# EasyEDA Pro project LVDS_VHDCI_1.0.eprj

# Schematic LVDS_VHDCI_MCU_1
Page Name: P1; Project Name: LVDS_VHDCI_1.0; Schematic Name: LVDS_VHDCI_MCU_1; Update Date: 2023-11-03; Company: 嘉立创EDA; Page Size: A4; Version: V1.0
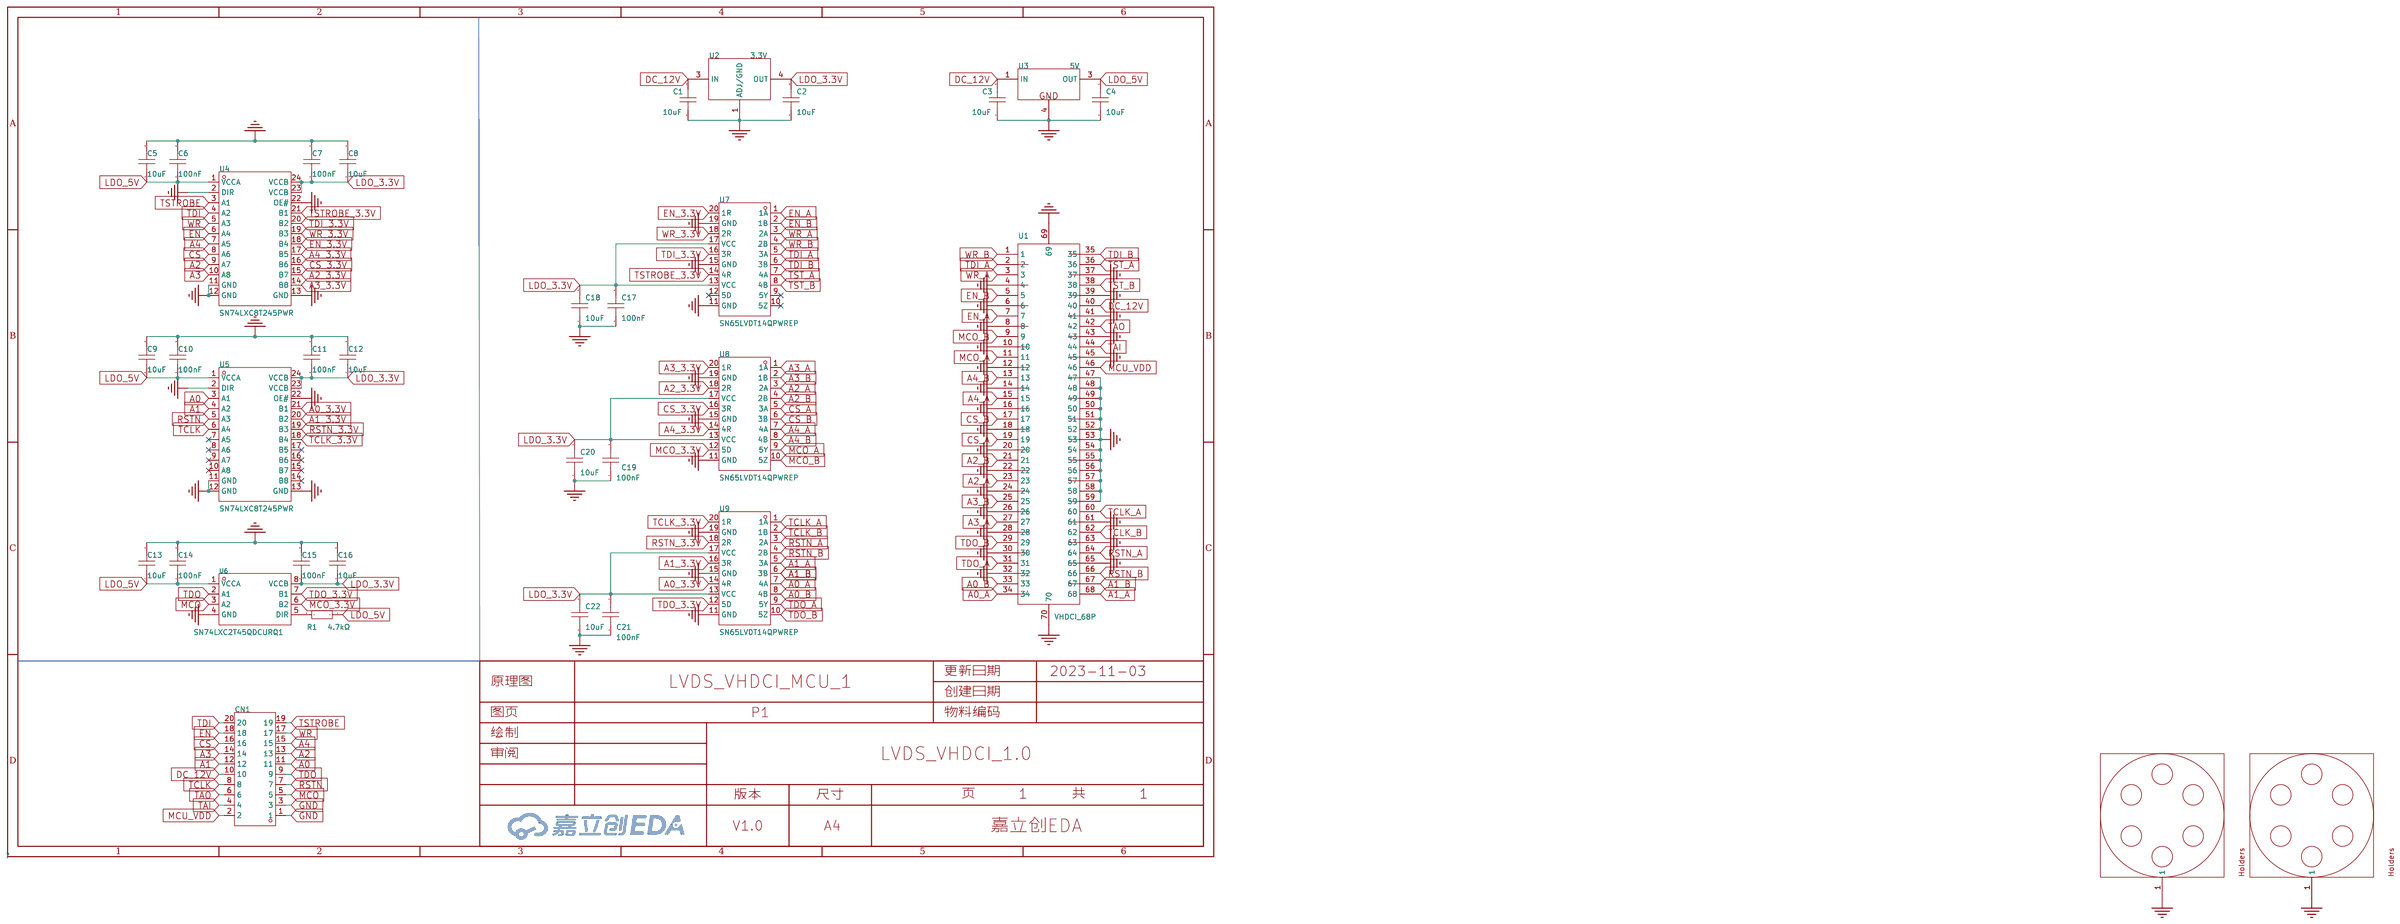
[diagram p0: schematic sheet]

## Parts
C1  10uF  [C0603]
C2  10uF  [C0603]
C3  10uF  [C0603]
C4  10uF  [C0603]
C5  10uF  [C0603]
C6  100nF  [C0603]
C7  100nF  [C0603]
C8  10uF  [C0603]
C9  10uF  [C0603]
C10  100nF  [C0603]
C11  100nF  [C0603]
C12  10uF  [C0603]
C13  10uF  [C0603]
C14  100nF  [C0603]
C15  100nF  [C0603]
C16  10uF  [C0603]
C17  100nF  [C0603]
C18  10uF  [C0603]
C19  100nF  [C0603]
C20  10uF  [C0603]
C21  100nF  [C0603]
C22  10uF  [C0603]
CN1  BH254V-20P  [CONN-TH_20P-P2.54_0702462001]
J5  -  [DEMO板安装孔]
J6  -  [DEMO板安装孔]
R1  4.7kΩ  [R0603]
U1  VHDCI_68P  [VHDCI_68P]
U2  3.3V  [TO-263-2_L10.0-W9.1-P5.08-LS15.2-TL]
U3  5V  [TO-263-2_L10.0-W9.1-P5.08-LS15.2-TL]
U4  SN74LXC8T245PWR  [TSSOP-24_L7.8-W4.4-P0.65-LS6.4-BL_1]
U5  SN74LXC8T245PWR  [TSSOP-24_L7.8-W4.4-P0.65-LS6.4-BL_1]
U6  SN74LXC2T45QDCURQ1  [VSSOP-8_L2.4-W2.1-P0.50-LS3.2-BL]
U7  SN65LVDT14QPWREP  [TSSOP-20_L6.5-W4.4-P0.65-LS6.4-BL]
U8  SN65LVDT14QPWREP  [TSSOP-20_L6.5-W4.4-P0.65-LS6.4-BL]
U9  SN65LVDT14QPWREP  [TSSOP-20_L6.5-W4.4-P0.65-LS6.4-BL]

## Library data of the parts
C1-C5 C8 C9 C12 C13 C16 C18 C20 C22 = CL10A106MA8NRNC: 容值:10uF;精度:±20%;额定电压:25V;材质(温度系数):X5R;; LCSC Part Name: 10uF ±20% 25V; Supplier Part: C96446; Manufacturer: SAMSUNG(三星); Supplier Footprint: 0603; JLCPCB Part Class: Basic Part; Datasheet: https://atta.szlcsc.com/upload/public/pdf/source/20170325/1490427913016.pdf; Supplier: LCSC; Tolerance: ±20%; Voltage Rated: 25V; Temperature Coefficient: X5R
C6 C7 C10 C11 C14 C15 C17 C19 C21 = CC0603KRX7R9BB104: 容值:100nF;精度:±10%;额定电压:50V;材质(温度系数):X7R;; LCSC Part Name: 100nF ±10% 50V; Supplier Part: C14663; Manufacturer: YAGEO(国巨); Supplier Footprint: 0603; JLCPCB Part Class: Basic Part; Datasheet: https://atta.szlcsc.com/upload/public/pdf/source/20180910/C282072_33301C7F631E79921B82A8DAC6BCC5B3.pdf; Supplier: LCSC; Tolerance: ±10%; Voltage Rated: 50V; Temperature Coefficient: X7R
CN1 = BH254V-20P: 连接器类型:简牛座;每排PIN数:10;结构:2x10P;排数:2;间距:2.54mm;行距:2.54mm;封装形式:直插;额定电流:3A;额定电压:250V;工作温度范围:-40℃~+105℃;; LCSC Part Name: 每排P数:10 2x10P 排数:2 2.54mm; Supplier Part: C492444; Manufacturer: XFCN(兴飞); Supplier Footprint: 插件,P=2.54mm; JLCPCB Part Class: Extended Part; Datasheet: https://atta.szlcsc.com/upload/public/pdf/source/20200312/C492444_4AABE2FC4F6BE8226B85135616AF0092.pdf; Supplier: LCSC; Connector Type: 简牛座; Pin Number in each Row: 10; Structure: 2x10P; Number of Rows: 2; Pitch: 2.54mm; Row Spacing: 2.54mm; Holder Type: 直插; Current Rating (Max): 3A; Voltage Rating (Max): 250V; Operating Temperature Range: -40℃~+105℃
J5 J6 = 螺孔_3.1X6MM
R1 = 0603WAF4701T5E: 电阻类型:厚膜电阻;阻值:4.7kΩ;精度:±1%;功率:100mW;温度系数:±100ppm/℃;; LCSC Part Name: 厚膜电阻 4.7kΩ ±1% 100mW; Supplier Part: C23162; Manufacturer: UNI-ROYAL(厚声); Supplier Footprint: 0603; JLCPCB Part Class: Basic Part; Datasheet: https://atta.szlcsc.com/upload/public/pdf/source/20200306/C422600_1E6D84923E4A46A82E41ADD87F860B5C.pdf; Supplier: LCSC; Type: 厚膜电阻; Tolerance: ±1%; Power(Watts): 100mW; Temperature Coefficient: ±100ppm/℃; Overload Voltage (Max): 75V; Operating Temperature Range: -55℃~+155℃
U1 = VHDCI_68P
U2 = LD1085D2T33R: 输出类型:固定;输出极性:正;最大输入电压:30V;输出电压:3.3V;输出电流:3A;电源纹波抑制比(PSRR):72dB@(120Hz);; Supplier Part: C7913; Manufacturer: ST(意法半导体); Supplier Footprint: TO-263; JLCPCB Part Class: Extended Part; Datasheet: https://atta.szlcsc.com/upload/public/pdf/source/20140724/1457707167525.pdf; Supplier: LCSC; Output Type: 固定; Output Polarity: 正; Number of Outputs: 1; Maximum Input Voltage: 30V; Dropout Voltage: 1.5V@(3A); Output Current: 3A; Power Supply Rejection Ratio (PSRR): 72dB@(120Hz)
U3 = L7805CD2T-TR: 输出类型:固定;输出极性:正;最大输入电压:35V;输出电压:5V;输出电流:1.5A;电源纹波抑制比(PSRR):62dB@(120Hz);; LCSC Part Name: 输入35V 输出5V 1.5A; Supplier Part: C15077; Manufacturer: ST(意法半导体); Supplier Footprint: TO-263; JLCPCB Part Class: Extended Part; Datasheet: https://atta.szlcsc.com/upload/public/pdf/source/20191219/C472632_C0855675BBC73B8C8E44EE1325AAD56A.pdf; Supplier: LCSC; Output Type: 固定; Output Polarity: 正; Number of Outputs: 1; Maximum Input Voltage: 35V; Dropout Voltage: 2V@(1A); Output Current: 1.5A; Power Supply Rejection Ratio (PSRR): 62dB@(120Hz)
U4 U5 = SN74LXC8T245PWR: 电路数:1;每个电路通道数:8;; Supplier Part: C4363995; Manufacturer: TI(德州仪器); Supplier Footprint: TSSOP-24; JLCPCB Part Class: Extended Part; Datasheet: https://www.ti.com/cn/lit/gpn/sn74lxc8t245; Supplier: LCSC; Number of Circuits: 1; Channels per Circuit: 8; Output Type: 三态; Operating Temperature: -40℃~+125℃
U6 = SN74LXC2T45QDCURQ1: Supplier Part: C6680938; Manufacturer: TI(德州仪器); Supplier Footprint: VSSOP-8; Supplier: LCSC
U7-U9 = SN65LVDT14QPWREP: Supplier Part: C2671582; Manufacturer: TI(德州仪器); Supplier Footprint: TSSOP-20; JLCPCB Part Class: Extended Part; Supplier: LCSC

## Nets
GND: C1.1 C2.1 C3.1 C4.1 C5.2 C6.2 C7.2 C8.2 C9.2 C10.2 C11.2 C12.2 C13.2 C14.2 C15.2 C16.2 C17.1 C18.1 C19.1 C20.1 C21.1 C22.1 CN1.1 CN1.3 J5.1 J6.1 U1.4 U1.6 U1.8 U1.10 U1.12 U1.14 U1.16 U1.18 U1.20 U1.22 U1.24 U1.26 U1.28 U1.30 U1.32 U1.37 U1.39 U1.41 U1.43 U1.45 U1.47 U1.48 U1.49 U1.50 U1.51 U1.52 U1.53 U1.54 U1.55 U1.56 U1.57 U1.58 U1.59 U1.61 U1.63 U1.65 U1.69 U1.70 U2.1(ADJ/GND) U3.4(GND) U4.2(DIR) U4.11(GND) U4.12(GND) U4.13(GND) U4.22(OE#) U5.2(DIR) U5.11(GND) U5.12(GND) U5.13(GND) U5.22(OE#) U6.4(GND) U7.11(GND) U7.15(GND) U7.19(GND) U8.11(GND) U8.15(GND) U8.19(GND) U9.11(GND) U9.15(GND) U9.19(GND)
A0: CN1.11 U5.3(A1)
A0_3.3V: U5.21(B1) U9.14(4R)
A0_A: U1.34 U9.7(4A)
A0_B: U1.33 U9.8(4B)
A1: CN1.12 U5.4(A2)
A1_3.3V: U5.20(B2) U9.16(3R)
A1_A: U1.68 U9.5(3A)
A1_B: U1.67 U9.6(3B)
A2: CN1.13 U4.9(A7)
A2_3.3V: U4.15(B7) U8.18(2R)
A2_A: U1.23 U8.3(2A)
A2_B: U1.21 U8.4(2B)
A3: CN1.14 U4.10(A8)
A3_3.3V: U4.14(B8) U8.20(1R)
A3_A: U1.27 U8.1(1A)
A3_B: U1.25 U8.2(1B)
A4: CN1.15 U4.7(A5)
A4_3.3V: U4.17(B5) U8.14(4R)
A4_A: U1.15 U8.7(4A)
A4_B: U1.13 U8.8(4B)
CS: CN1.16 U4.8(A6)
CS_3.3V: U4.16(B6) U8.16(3R)
CS_A: U1.19 U8.5(3A)
CS_B: U1.17 U8.6(3B)
DC_12V: C1.2 C3.2 CN1.10 U1.40 U2.3(IN) U3.1(IN)
EN: CN1.18 U4.6(A4)
EN_3.3V: U4.18(B4) U7.20(1R)
EN_A: U1.7 U7.1(1A)
EN_B: U1.5 U7.2(1B)
LDO_3.3V: C2.2 C7.1 C8.1 C11.1 C12.1 C15.1 C16.1 C17.2 C18.2 C19.2 C20.2 C21.2 C22.2 U2.4(OUT) U4.23(VCCB) U4.24(VCCB) U5.23(VCCB) U5.24(VCCB) U6.8(VCCB) U7.13(VCC) U7.17(VCC) U8.13(VCC) U8.17(VCC) U9.13(VCC) U9.17(VCC)
LDO_5V: C4.2 C5.1 C6.1 C9.1 C10.1 C13.1 C14.1 R1.1 U3.3(OUT) U4.1(VCCA) U5.1(VCCA) U6.1(VCCA)
MCO: CN1.5 U6.3(A2)
MCO_3.3V: U6.6(B2) U8.12(5D)
MCO_A: U1.11 U8.9(5Y)
MCO_B: U1.9 U8.10(5Z)
MCU_VDD: CN1.2 U1.46
RSTN: CN1.7 U5.5(A3)
RSTN_3.3V: U5.19(B3) U9.18(2R)
RSTN_A: U1.64 U9.3(2A)
RSTN_B: U1.66 U9.4(2B)
TAI: CN1.4 U1.44
TAO: CN1.6 U1.42
TCLK: CN1.8 U5.6(A4)
TCLK_3.3V: U5.18(B4) U9.20(1R)
TCLK_A: U1.60 U9.1(1A)
TCLK_B: U1.62 U9.2(1B)
TDI: CN1.20 U4.4(A2)
TDI_3.3V: U4.20(B2) U7.16(3R)
TDI_A: U1.2 U7.5(3A)
TDI_B: U1.35 U7.6(3B)
TDO: CN1.9 U6.2(A1)
TDO_3.3V: U6.7(B1) U9.12(5D)
TDO_A: U1.31 U9.9(5Y)
TDO_B: U1.29 U9.10(5Z)
TST_A: U1.36 U7.7(4A)
TST_B: U1.38 U7.8(4B)
TSTROBE: CN1.19 U4.3(A1)
TSTROBE_3.3V: U4.21(B1) U7.14(4R)
WR: CN1.17 U4.5(A3)
WR_3.3V: U4.19(B3) U7.18(2R)
WR_A: U1.3 U7.3(2A)
WR_B: U1.1 U7.4(2B)
$1N4575: R1.2 U6.5(DIR)

Not connected (* = marked no-connect by the designer): U5 7(A5)* 8(A6)* 9(A7)* 10(A8)* 14(B8)* 15(B7)* 16(B6)* 17(B5)*; U7 9(5Y)* 10(5Z)* 12(5D)*

# Schematic LVDS_VHDCI_NI_1
Page Name: P1; Project Name: LVDS_VHDCI_1.0; Schematic Name: LVDS_VHDCI_NI_1; Update Date: 2023-11-03; Company: 嘉立创EDA; Page Size: A4; Version: V1.0
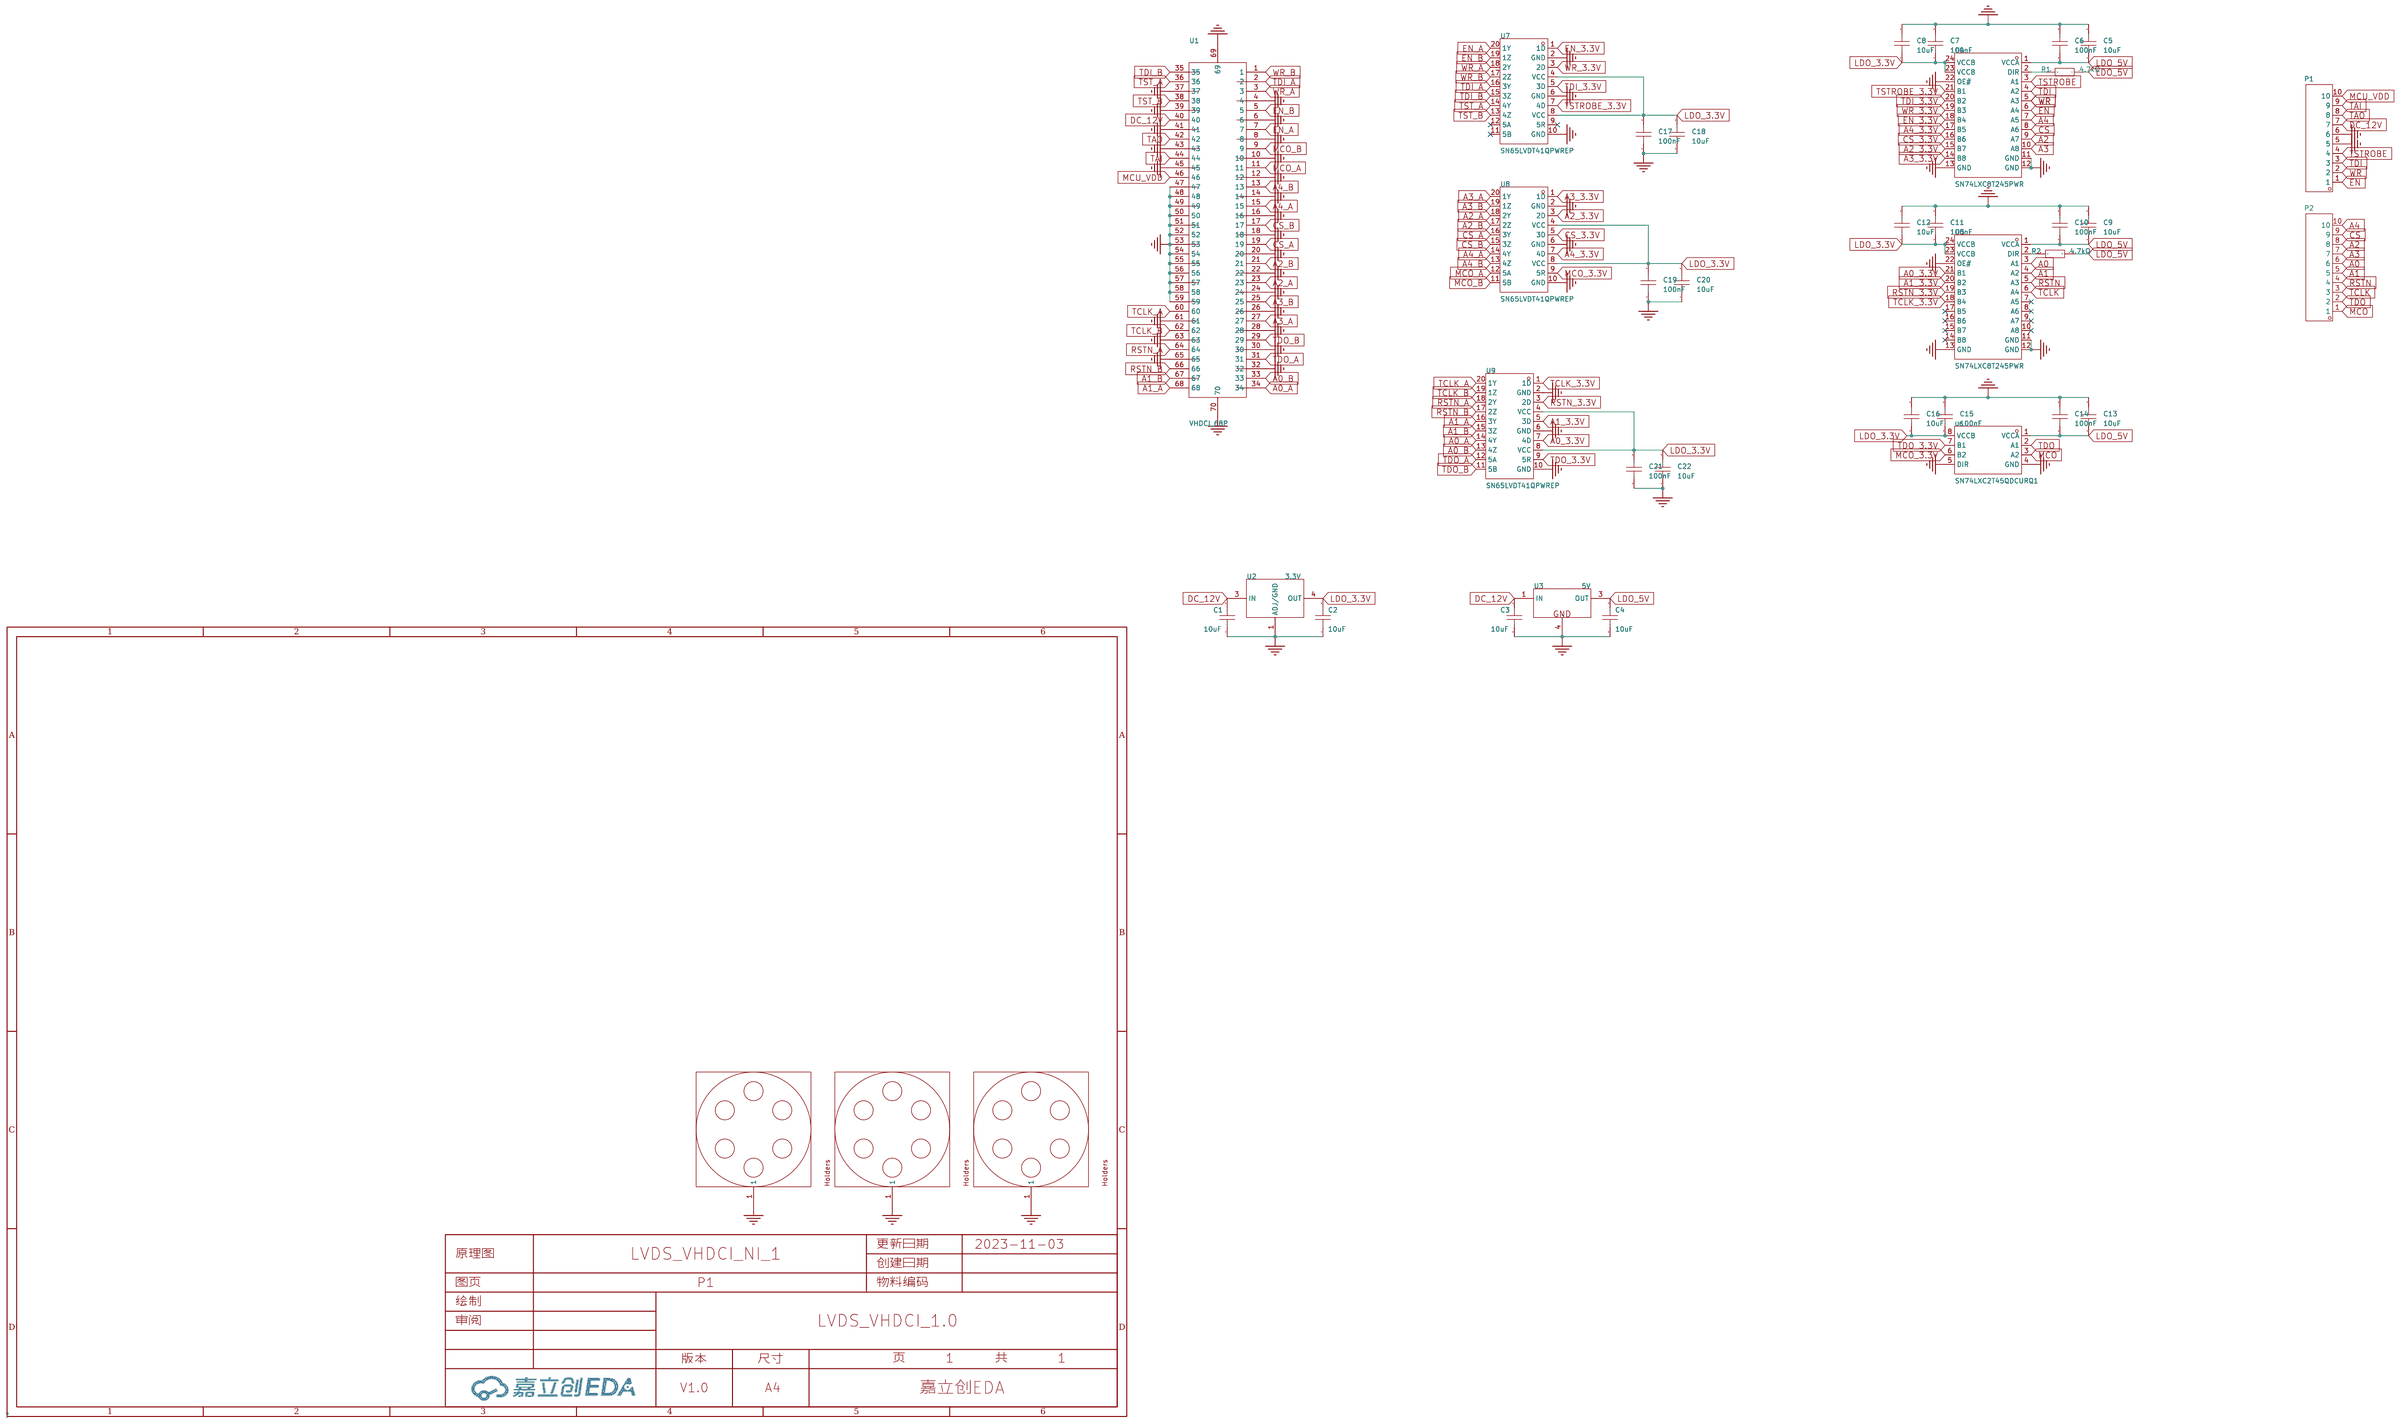
[diagram p1: schematic sheet]

## Parts
C1  10uF  [C0603]
C2  10uF  [C0603]
C3  10uF  [C0603]
C4  10uF  [C0603]
C5  10uF  [C0603]
C6  100nF  [C0603]
C7  100nF  [C0603]
C8  10uF  [C0603]
C9  10uF  [C0603]
C10  100nF  [C0603]
C11  100nF  [C0603]
C12  10uF  [C0603]
C13  10uF  [C0603]
C14  100nF  [C0603]
C15  100nF  [C0603]
C16  10uF  [C0603]
C17  100nF  [C0603]
C18  10uF  [C0603]
C19  100nF  [C0603]
C20  10uF  [C0603]
C21  100nF  [C0603]
C22  10uF  [C0603]
J6  -  [DEMO板安装孔]
J7  -  [DEMO板安装孔]
J8  -  [DEMO板安装孔]
P1  WJ15EDGRC-3.81-10P  [CONN-TH_10P-P3.81_WJ15EDGRC-3.81-10P]
P2  WJ15EDGRC-3.81-10P  [CONN-TH_10P-P3.81_WJ15EDGRC-3.81-10P]
R1  4.7kΩ  [R0603]
R2  4.7kΩ  [R0603]
U1  VHDCI_68P  [VHDCI_68P]
U2  3.3V  [TO-263-2_L10.0-W9.1-P5.08-LS15.2-TL]
U3  5V  [TO-263-2_L10.0-W9.1-P5.08-LS15.2-TL]
U4  SN74LXC8T245PWR  [TSSOP-24_L7.8-W4.4-P0.65-LS6.4-BL_1]
U5  SN74LXC8T245PWR  [TSSOP-24_L7.8-W4.4-P0.65-LS6.4-BL_1]
U6  SN74LXC2T45QDCURQ1  [VSSOP-8_L2.4-W2.1-P0.50-LS3.2-BL]
U7  SN65LVDT41QPWREP  [TSSOP-20_L6.5-W4.4-P0.65-LS6.4-BL]
U8  SN65LVDT41QPWREP  [TSSOP-20_L6.5-W4.4-P0.65-LS6.4-BL]
U9  SN65LVDT41QPWREP  [TSSOP-20_L6.5-W4.4-P0.65-LS6.4-BL]

## Library data of the parts
C1-C5 C8 C9 C12 C13 C16 C18 C20 C22 = CL10A106MA8NRNC: 容值:10uF;精度:±20%;额定电压:25V;材质(温度系数):X5R;; LCSC Part Name: 10uF ±20% 25V; Supplier Part: C96446; Manufacturer: SAMSUNG(三星); Supplier Footprint: 0603; JLCPCB Part Class: Basic Part; Datasheet: https://atta.szlcsc.com/upload/public/pdf/source/20170325/1490427913016.pdf; Supplier: LCSC; Tolerance: ±20%; Voltage Rated: 25V; Temperature Coefficient: X5R
C6 C7 C10 C11 C14 C15 C17 C19 C21 = CC0603KRX7R9BB104: 容值:100nF;精度:±10%;额定电压:50V;材质(温度系数):X7R;; LCSC Part Name: 100nF ±10% 50V; Supplier Part: C14663; Manufacturer: YAGEO(国巨); Supplier Footprint: 0603; JLCPCB Part Class: Basic Part; Datasheet: https://atta.szlcsc.com/upload/public/pdf/source/20180910/C282072_33301C7F631E79921B82A8DAC6BCC5B3.pdf; Supplier: LCSC; Tolerance: ±10%; Voltage Rated: 50V; Temperature Coefficient: X7R
J6-J8 = 螺孔_3.1X6MM
P1 P2 = WJ15EDGRC-3.81-10P: 连接器类型:板端/插座-闭口;间距:3.81mm;排数:1;每排PIN数:10;安装方式:弯针;颜色:绿色;; LCSC Part Name: 板端/插座-闭口 3.81mm 排数:1 每排P数:10 弯针; Supplier Part: C26895; Manufacturer: KANGNEX(康奈克斯电气); Supplier Footprint: P=3.81mm; JLCPCB Part Class: Extended Part; Datasheet: https://atta.szlcsc.com/upload/public/pdf/source/20191225/C26895_4D916DB43CEF69A0001F97FDF773E4BF.pdf; Supplier: LCSC; Connector Type: 板端/插座-闭口; Pitch: 3.81mm; Number of Rows: 1; Number of PINs Per Row: 10; Mounting Style: 弯针; Color: 绿色
R1 R2 = 0603WAF4701T5E: 电阻类型:厚膜电阻;阻值:4.7kΩ;精度:±1%;功率:100mW;温度系数:±100ppm/℃;; LCSC Part Name: 厚膜电阻 4.7kΩ ±1% 100mW; Supplier Part: C23162; Manufacturer: UNI-ROYAL(厚声); Supplier Footprint: 0603; JLCPCB Part Class: Basic Part; Datasheet: https://atta.szlcsc.com/upload/public/pdf/source/20200306/C422600_1E6D84923E4A46A82E41ADD87F860B5C.pdf; Supplier: LCSC; Type: 厚膜电阻; Tolerance: ±1%; Power(Watts): 100mW; Temperature Coefficient: ±100ppm/℃; Overload Voltage (Max): 75V; Operating Temperature Range: -55℃~+155℃
U1 = VHDCI_68P
U2 = LD1085D2T33R: 输出类型:固定;输出极性:正;最大输入电压:30V;输出电压:3.3V;输出电流:3A;电源纹波抑制比(PSRR):72dB@(120Hz);; Supplier Part: C7913; Manufacturer: ST(意法半导体); Supplier Footprint: TO-263; JLCPCB Part Class: Extended Part; Datasheet: https://atta.szlcsc.com/upload/public/pdf/source/20140724/1457707167525.pdf; Supplier: LCSC; Output Type: 固定; Output Polarity: 正; Number of Outputs: 1; Maximum Input Voltage: 30V; Dropout Voltage: 1.5V@(3A); Output Current: 3A; Power Supply Rejection Ratio (PSRR): 72dB@(120Hz)
U3 = L7805CD2T-TR: 输出类型:固定;输出极性:正;最大输入电压:35V;输出电压:5V;输出电流:1.5A;电源纹波抑制比(PSRR):62dB@(120Hz);; LCSC Part Name: 输入35V 输出5V 1.5A; Supplier Part: C15077; Manufacturer: ST(意法半导体); Supplier Footprint: TO-263; JLCPCB Part Class: Extended Part; Datasheet: https://atta.szlcsc.com/upload/public/pdf/source/20191219/C472632_C0855675BBC73B8C8E44EE1325AAD56A.pdf; Supplier: LCSC; Output Type: 固定; Output Polarity: 正; Number of Outputs: 1; Maximum Input Voltage: 35V; Dropout Voltage: 2V@(1A); Output Current: 1.5A; Power Supply Rejection Ratio (PSRR): 62dB@(120Hz)
U4 U5 = SN74LXC8T245PWR: 电路数:1;每个电路通道数:8;; Supplier Part: C4363995; Manufacturer: TI(德州仪器); Supplier Footprint: TSSOP-24; JLCPCB Part Class: Extended Part; Datasheet: https://www.ti.com/cn/lit/gpn/sn74lxc8t245; Supplier: LCSC; Number of Circuits: 1; Channels per Circuit: 8; Output Type: 三态; Operating Temperature: -40℃~+125℃
U6 = SN74LXC2T45QDCURQ1: Supplier Part: C6680938; Manufacturer: TI(德州仪器); Supplier Footprint: VSSOP-8; Supplier: LCSC
U7-U9 = SN65LVDT41QPWREP: 增强型产品 Memorystick 内部互联扩展器芯片组 20-TSSOP -40 to 125; Supplier Part: C2671573; Manufacturer: TI(德州仪器); Supplier Footprint: TSSOP-20; JLCPCB Part Class: Extended Part; Datasheet: https://atta.szlcsc.com/upload/public/pdf/source/20230222/A9E90D382735C7FE7592B0604DF3BA3F.pdf; Supplier: LCSC

## Nets
GND: C1.1 C2.1 C3.1 C4.1 C5.2 C6.2 C7.2 C8.2 C9.2 C10.2 C11.2 C12.2 C13.2 C14.2 C15.2 C16.2 C17.1 C18.1 C19.1 C20.1 C21.1 C22.1 J6.1 J7.1 J8.1 P1.5 P1.6 U1.4 U1.6 U1.8 U1.10 U1.12 U1.14 U1.16 U1.18 U1.20 U1.22 U1.24 U1.26 U1.28 U1.30 U1.32 U1.37 U1.39 U1.41 U1.43 U1.45 U1.47 U1.48 U1.49 U1.50 U1.51 U1.52 U1.53 U1.54 U1.55 U1.56 U1.57 U1.58 U1.59 U1.61 U1.63 U1.65 U1.69 U1.70 U2.1(ADJ/GND) U3.4(GND) U4.11(GND) U4.12(GND) U4.13(GND) U4.22(OE#) U5.11(GND) U5.12(GND) U5.13(GND) U5.22(OE#) U6.4(GND) U6.5(DIR) U7.2(GND) U7.6(GND) U7.10(GND) U8.2(GND) U8.6(GND) U8.10(GND) U9.2(GND) U9.6(GND) U9.10(GND)
A0: P2.6 U5.3(A1)
A0_3.3V: U5.21(B1) U9.7(4D)
A0_A: U1.34 U9.14(4Y)
A0_B: U1.33 U9.13(4Z)
A1: P2.5 U5.4(A2)
A1_3.3V: U5.20(B2) U9.5(3D)
A1_A: U1.68 U9.16(3Y)
A1_B: U1.67 U9.15(3Z)
A2: P2.8 U4.9(A7)
A2_3.3V: U4.15(B7) U8.3(2D)
A2_A: U1.23 U8.18(2Y)
A2_B: U1.21 U8.17(2Z)
A3: P2.7 U4.10(A8)
A3_3.3V: U4.14(B8) U8.1(1D)
A3_A: U1.27 U8.20(1Y)
A3_B: U1.25 U8.19(1Z)
A4: P2.10 U4.7(A5)
A4_3.3V: U4.17(B5) U8.7(4D)
A4_A: U1.15 U8.14(4Y)
A4_B: U1.13 U8.13(4Z)
CS: P2.9 U4.8(A6)
CS_3.3V: U4.16(B6) U8.5(3D)
CS_A: U1.19 U8.16(3Y)
CS_B: U1.17 U8.15(3Z)
DC_12V: C1.2 C3.2 P1.7 U1.40 U2.3(IN) U3.1(IN)
EN: P1.1 U4.6(A4)
EN_3.3V: U4.18(B4) U7.1(1D)
EN_A: U1.7 U7.20(1Y)
EN_B: U1.5 U7.19(1Z)
LDO_3.3V: C2.2 C7.1 C8.1 C11.1 C12.1 C15.1 C16.1 C17.2 C18.2 C19.2 C20.2 C21.2 C22.2 U2.4(OUT) U4.23(VCCB) U4.24(VCCB) U5.23(VCCB) U5.24(VCCB) U6.8(VCCB) U7.4(VCC) U7.8(VCC) U8.4(VCC) U8.8(VCC) U9.4(VCC) U9.8(VCC)
LDO_5V: C4.2 C5.1 C6.1 C9.1 C10.1 C13.1 C14.1 R1.1 R2.1 U3.3(OUT) U4.1(VCCA) U5.1(VCCA) U6.1(VCCA)
MCO: P2.1 U6.3(A2)
MCO_3.3V: U6.6(B2) U8.9(5R)
MCO_A: U1.11 U8.12(5A)
MCO_B: U1.9 U8.11(5B)
MCU_VDD: P1.10 U1.46
RSTN: P2.4 U5.5(A3)
RSTN_3.3V: U5.19(B3) U9.3(2D)
RSTN_A: U1.64 U9.18(2Y)
RSTN_B: U1.66 U9.17(2Z)
TAI: P1.9 U1.44
TAO: P1.8 U1.42
TCLK: P2.3 U5.6(A4)
TCLK_3.3V: U5.18(B4) U9.1(1D)
TCLK_A: U1.60 U9.20(1Y)
TCLK_B: U1.62 U9.19(1Z)
TDI: P1.3 U4.4(A2)
TDI_3.3V: U4.20(B2) U7.5(3D)
TDI_A: U1.2 U7.16(3Y)
TDI_B: U1.35 U7.15(3Z)
TDO: P2.2 U6.2(A1)
TDO_3.3V: U6.7(B1) U9.9(5R)
TDO_A: U1.31 U9.12(5A)
TDO_B: U1.29 U9.11(5B)
TST_A: U1.36 U7.14(4Y)
TST_B: U1.38 U7.13(4Z)
TSTROBE: P1.4 U4.3(A1)
TSTROBE_3.3V: U4.21(B1) U7.7(4D)
WR: P1.2 U4.5(A3)
WR_3.3V: U4.19(B3) U7.3(2D)
WR_A: U1.3 U7.18(2Y)
WR_B: U1.1 U7.17(2Z)
$1N21690: R1.2 U4.2(DIR)
$1N21773: R2.2 U5.2(DIR)

Not connected (* = marked no-connect by the designer): U5 7(A5)* 8(A6)* 9(A7)* 10(A8)* 14(B8)* 15(B7)* 16(B6)* 17(B5)*; U7 9(5R)* 11(5B)* 12(5A)*

# Board LVDS_VHDCI_MCU_1
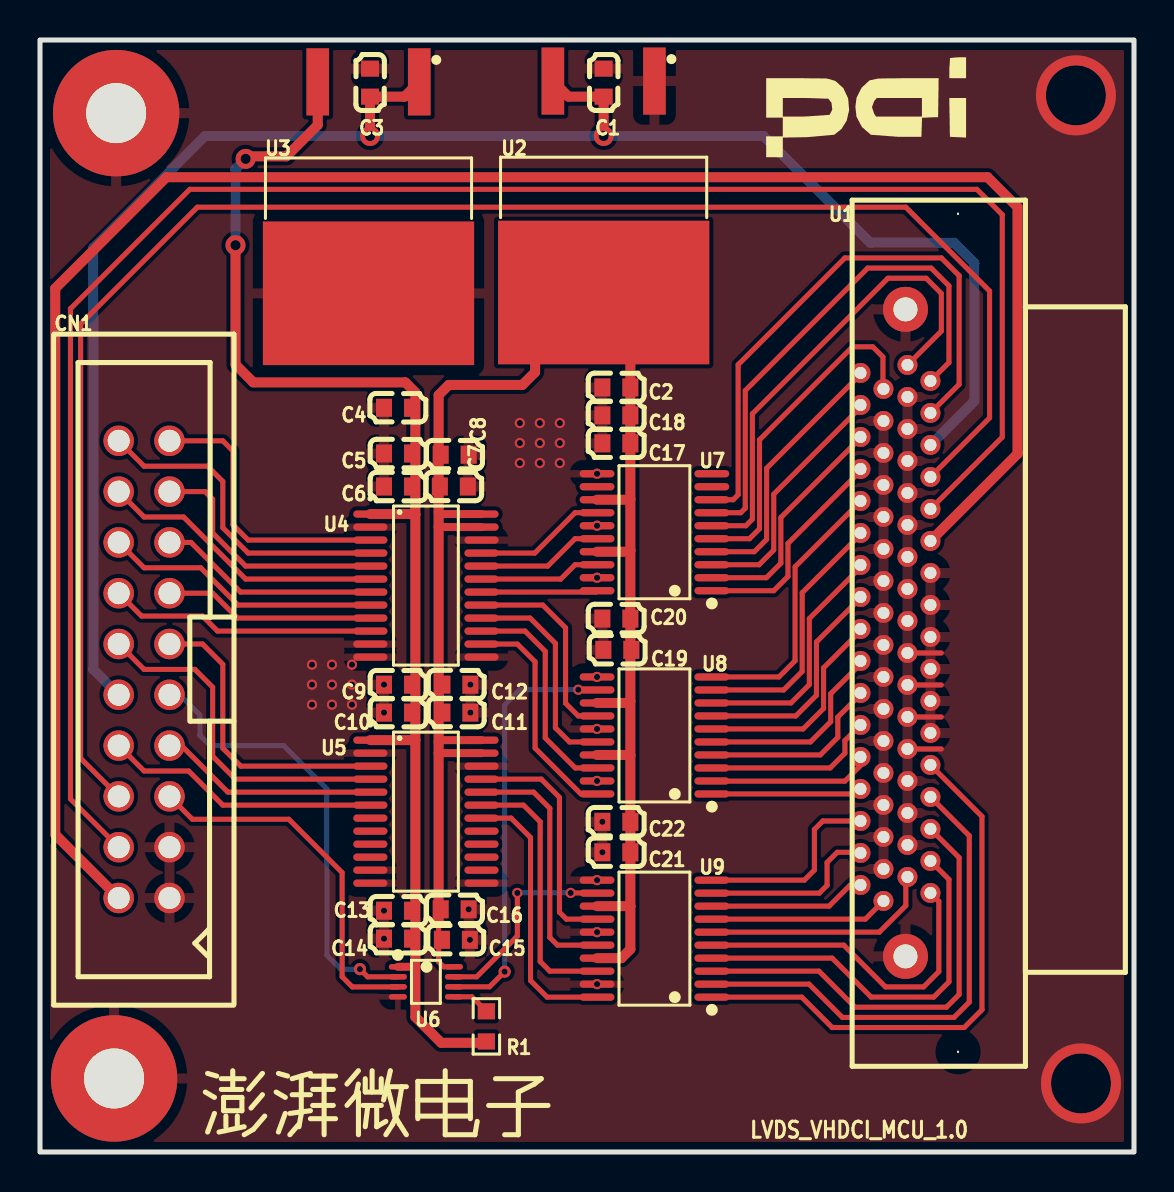
[diagram p2: board, top side]
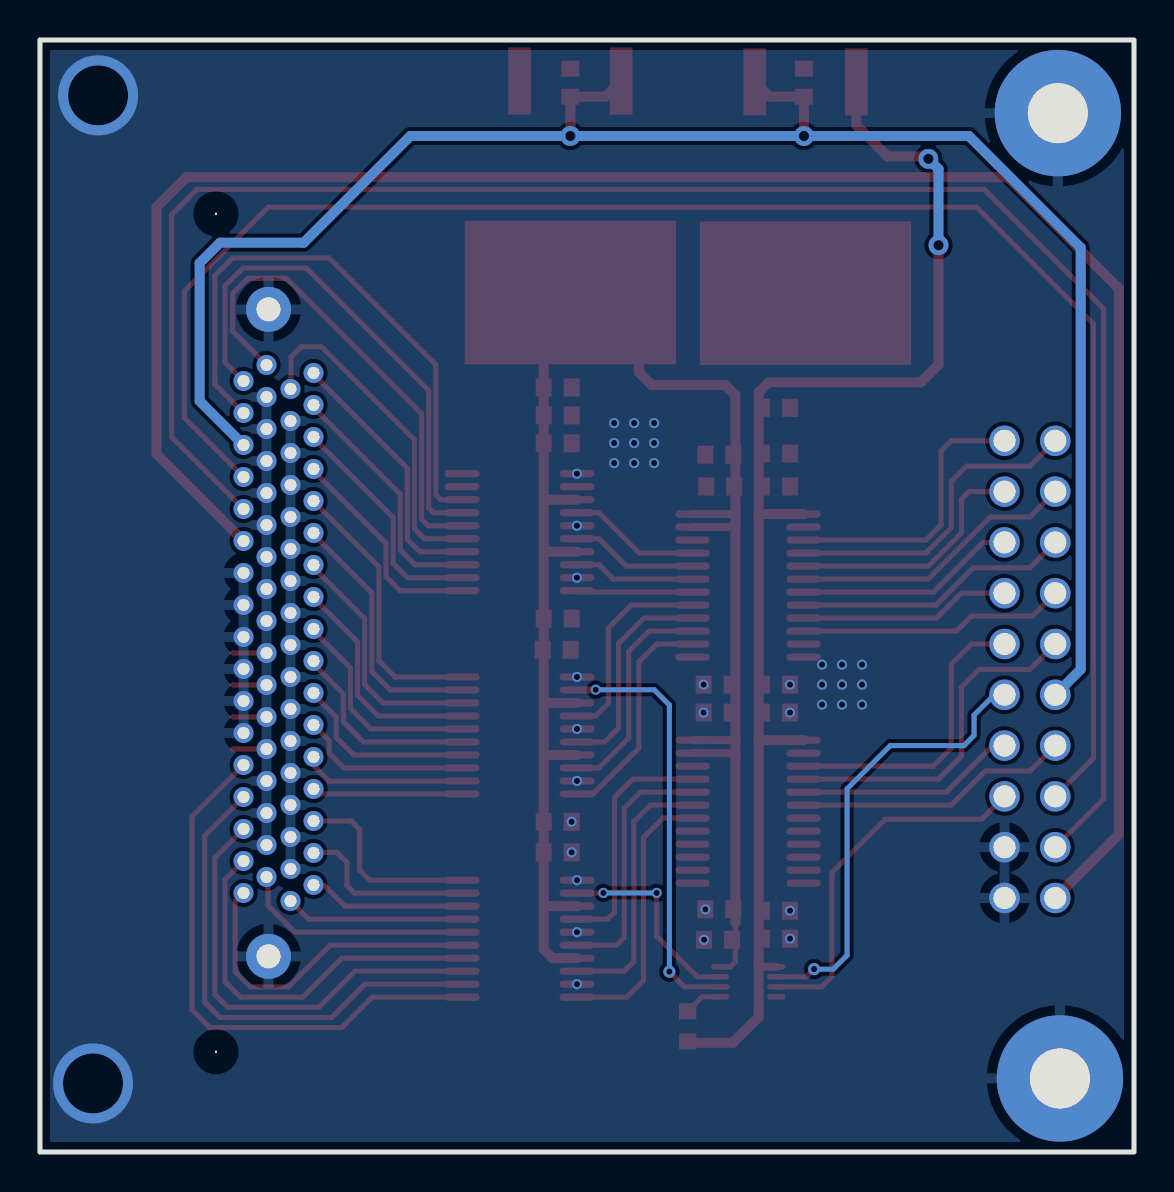
[diagram p3: board, bottom side, seen from below]

Outline 54.72 x 55.6 mm; copper layers: Top Layer, Bottom Layer. Coordinates in mm from the lower left corner of the outline.
Outline path: rectangle 0,55.6 54.72,0
Stack: Top Layer 0.035mm / Dielectric1 1.51mm FR4 er 4.5 / Bottom Layer 0.035mm

## Design rules (mm)
template: 自定义配置
spacing copperThickness1oz (default): track to track 0.102, other pairs 0.152 to 0.3
spacing copperThickness2oz: track to track 0.203, other pairs 0.152 to 0.3
track width copperThickness1oz (default): min 0.127, default 0.254, max 2.54
track width copperThickness2oz: min 0.203, default 0.254, max 2.54
differential pair differentialPair (default): width min 0.127, default 0.254, max 2.54; gap min 0.152, default 0.152
via viaSize (default): diameter min 0.5, default 0.61, max 10; hole min 0.3, default 0.305, max 6.3

## Placement (name value [footprint] x y rotation side)
C1  10uF  [C0603]  28.19 53.47 270 top
C2  10uF  [C0603]  28.83 38.23 0 top
C3  10uF  [C0603]  16.51 53.47 270 top
C4  10uF  [C0603]  17.91 37.21 0 top
C5  10uF  [C0603]  17.91 34.92 180 top
C6  100nF  [C0603]  17.91 33.27 180 top
C7  100nF  [C0603]  20.7 33.27 0 top
C8  10uF  [C0603]  20.74 34.87 0 top
C9  10uF  [C0603]  17.91 23.37 180 top
C10  100nF  [C0603]  17.91 21.97 180 top
C11  100nF  [C0603]  20.83 21.97 0 top
C12  10uF  [C0603]  20.83 23.37 0 top
C13  10uF  [C0603]  17.91 12.06 180 top
C14  100nF  [C0603]  17.91 10.67 180 top
C15  100nF  [C0603]  20.8 10.61 0 top
C16  10uF  [C0603]  20.74 12.13 0 top
C17  100nF  [C0603]  28.83 35.43 0 top
C18  10uF  [C0603]  28.83 36.83 0 top
C19  100nF  [C0603]  28.88 25.11 0 top
C20  10uF  [C0603]  28.83 26.67 0 top
C21  100nF  [C0603]  28.83 14.99 0 top
C22  10uF  [C0603]  28.83 16.51 0 top
CN1  BH254V-20P  [CONN-TH_20P-P2.54_0702462001]  5.21 24.13 90 top
J5  -  [DEMO板安装孔]  3.81 51.94 0 top
J6  -  [DEMO板安装孔]  3.71 3.68 0 top
R1  4.7kΩ  [R0603]  22.33 6.28 90 top
U1  -  [VHDCI_68P]  49.66 24.51 0 top
U2  3.3V  [TO-263-2_L10.0-W9.1-P5.08-LS15.2-TL]  28.19 48.26 270 top
U3  5V  [TO-263-2_L10.0-W9.1-P5.08-LS15.2-TL]  16.43 48.22 270 top
U4  SN74LXC8T245PWR  [TSSOP-24_L7.8-W4.4-P0.65-LS6.4-BL_1]  19.3 28.32 270 top
U5  SN74LXC8T245PWR  [TSSOP-24_L7.8-W4.4-P0.65-LS6.4-BL_1]  19.3 17.02 270 top
U6  SN74LXC2T45QDCURQ1  [VSSOP-8_L2.4-W2.1-P0.50-LS3.2-BL]  19.3 8.51 270 top
U7  SN65LVDT14QPWREP  [TSSOP-20_L6.5-W4.4-P0.65-LS6.4-BL]  30.73 30.99 90 top
U8  SN65LVDT14QPWREP  [TSSOP-20_L6.5-W4.4-P0.65-LS6.4-BL]  30.73 20.83 90 top
U9  SN65LVDT14QPWREP  [TSSOP-20_L6.5-W4.4-P0.65-LS6.4-BL]  30.73 10.67 90 top

## Footprints (pads in the part's own frame, mm; a bottom-side part is the same pattern mirrored in y, then rotated)
C0603
  rect 0.8x0.9 smd: 1(-0.7,0) 2(0.7,0)
CONN-TH_20P-P2.54_0702462001
  round 1.524 hole 1.1: 1(-11.43,-1.27) 2(-11.43,1.27) 3(-8.89,-1.27) 4(-8.89,1.27) 5(-6.35,-1.27) 6(-6.35,1.27) 7(-3.81,-1.27) 8(-3.81,1.27) 9(-1.27,-1.27) 10(-1.27,1.27) 11(1.27,-1.27) 12(1.27,1.27) 13(3.81,-1.27) 14(3.81,1.27) 15(6.35,-1.27) 16(6.35,1.27) 17(8.89,-1.27) 18(8.89,1.27) 19(11.43,-1.27) 20(11.43,1.27)
DEMO板安装孔
  round 6.32 hole 3: 1(0,0)
R0603
  rect 0.806x0.864 smd: 1(-0.753,0) 2(0.753,0)
TO-263-2_L10.0-W9.1-P5.08-LS15.2-TL
  rect 3.358x1.134 smd: 1(-5.286,2.54) 3(-5.286,-2.54)
  rect 7.181x10.566 smd: 4(5.286,0)
TSSOP-20_L6.5-W4.4-P0.65-LS6.4-BL
  oval 0.364x1.742 smd: 1(-2.925,-2.871) 2(-2.275,-2.871) 3(-1.625,-2.871) 4(-0.975,-2.871) 5(-0.325,-2.871) 6(0.325,-2.871) 7(0.975,-2.871) 8(1.625,-2.871) 9(2.275,-2.871) 10(2.925,-2.871) 11(2.925,2.871) 12(2.275,2.871) 13(1.625,2.871) 14(0.975,2.871) 15(0.325,2.871) 16(-0.325,2.871) 17(-0.975,2.871) 18(-1.625,2.871) 19(-2.275,2.871) 20(-2.925,2.871)
TSSOP-24_L7.8-W4.4-P0.65-LS6.4-BL_1
  oval 0.364x1.71 smd: 1(-3.575,-2.78) 2(-2.925,-2.78) 3(-2.275,-2.78) 4(-1.625,-2.78) 5(-0.975,-2.78) 6(-0.325,-2.78) 7(0.325,-2.78) 8(0.975,-2.78) 9(1.625,-2.78) 10(2.275,-2.78) 11(2.925,-2.78) 12(3.575,-2.78) 13(3.575,2.78) 14(2.925,2.78) 15(2.275,2.78) 16(1.625,2.78) 17(0.975,2.78) 18(0.325,2.78) 19(-0.325,2.78) 20(-0.975,2.78) 21(-1.625,2.78) 22(-2.275,2.78) 23(-2.925,2.78) 24(-3.575,2.78)
VHDCI_68P
  round 1 hole 0.6: 1(-8.617,14.441) 2(-7.466,13.64) 3(-8.617,12.841) 4(-7.466,12.04) 5(-8.617,11.241) 6(-7.466,10.441) 7(-8.617,9.64) 8(-7.466,8.841) 9(-8.617,8.04) 10(-7.466,7.24) 11(-8.617,6.441) 12(-7.466,5.641) 13(-8.617,4.84) 14(-7.466,4.04) 15(-8.617,3.24) 16(-7.466,2.441) 17(-8.617,1.641) 18(-7.466,0.841) 19(-8.617,0.041) 20(-7.466,-0.759) 21(-8.617,-1.56) 22(-7.466,-2.36) 23(-8.617,-3.159) 24(-7.466,-3.959) 25(-8.617,-4.76) 26(-7.466,-5.559) 27(-8.617,-6.359) 28(-7.466,-7.16) 29(-8.617,-7.96) 30(-7.466,-8.759) 31(-8.617,-9.559) 32(-7.466,-10.36) 33(-8.617,-11.159) 34(-7.466,-11.96) 35(-6.266,14.841) 36(-5.117,14.04) 37(-6.266,13.241) 38(-5.117,12.441) 39(-6.266,11.64) 40(-5.117,10.841) 41(-6.266,10.04) 42(-5.117,9.241) 43(-6.266,8.441) 44(-5.117,7.641) 45(-6.266,6.84) 46(-5.117,6.04) 47(-6.266,5.24) 48(-5.117,4.441) 49(-6.266,3.64) 50(-5.117,2.841) 51(-6.266,2.041) 52(-5.117,1.24) 53(-6.266,0.441) 54(-5.117,-0.359) 55(-6.266,-1.159) 56(-5.117,-1.96) 57(-6.266,-2.76) 58(-5.117,-3.559) 59(-6.266,-4.359) 60(-5.117,-5.16) 61(-6.266,-5.96) 62(-5.117,-6.76) 63(-6.266,-7.559) 64(-5.117,-8.36) 65(-6.266,-9.159) 66(-5.117,-9.96) 67(-6.266,-10.759) 68(-5.117,-11.559)
  round 2.25 hole 1.2: 69(-6.367,17.62) 70(-6.367,-14.729)
  round 0.1 hole 1.75: 71(-3.736,22.401) 72(-3.736,-19.5)
VSSOP-8_L2.4-W2.1-P0.50-LS3.2-BL
  oval 0.28x0.905 smd: 1(-0.75,-1.403) 2(-0.25,-1.403) 3(0.25,-1.403) 4(0.75,-1.403) 5(0.75,1.403) 6(0.25,1.403) 7(-0.25,1.403) 8(-0.75,1.403)

## Nets
As in the schematic.

Pads without a net: U1 71 72; U5 7 8 9 10 14 15 16 17; U7 9 10 12

## Via types
v1: diameter 1, hole 0.51, Top Layer to Bottom Layer, 4 vias
v2: diameter 0.51, hole 0.31, Top Layer to Bottom Layer, 40 vias
v3: diameter 4, hole 3, Top Layer to Bottom Layer, 2 vias
v4: diameter 0.61, hole 0.31, Top Layer to Bottom Layer, 2 vias

## Routing (per net, layer and track width the routed paths; a pad name or vN(x,y) marks a point on that pad's centre or on a via; arc(x,y) is an arc through that point)
GND: length 6.8
  Top Layer w0.254: U1.55 45.08,23.35 ; U1.53 45.08,24.95 ; U1.59 45.08,20.15 ; U1.57 45.08,21.75
  vias: v2(13.61,24.37) v2(13.61,23.37) v2(13.61,22.37) v2(14.61,24.37) v2(14.61,23.37) v2(14.61,22.37) v2(15.61,24.37) v2(15.61,23.37) v2(15.61,22.37) v2(17.21,23.37) v2(17.21,21.97) v2(17.21,12.06) v2(17.21,10.67) v2(21.44,12.13) v2(21.53,23.37) v2(21.53,21.97) v2(21.5,10.61) v2(24,36.45) v2(24,35.45) v2(24,34.45) v2(25,36.45) v2(25,35.45) v2(25,34.45) v2(26,36.45) v2(26,35.45) v2(26,34.45) v2(27.86,33.91) v2(27.86,31.31) v2(27.86,28.71) v2(27.86,23.75) v2(27.86,21.15) v2(27.86,18.55) v2(27.86,13.59) v2(27.86,10.99) v2(27.86,8.39) v2(28.13,16.51) v2(28.13,14.99) v3(51.82,52.83) v3(52.07,3.43)
A0: length 15
  Top Layer w0.254: CN1.11 8.13,25.4 9.14,24.38 9.14,20.19 10.04,19.29 U5.3
A0_3.3V: length 12
  Top Layer w0.254: U9.14 26.33,11.64 25.98,11.99 25.98,17.73 25.07,18.64 U5.21
A0_A: length 9
  Top Layer w0.254: U1.34 41.28,11.64 U9.7
A0_B: length 7.9
  Top Layer w0.254: U1.33 41.02,13.33 40.51,13.33 39.47,12.29 U9.8
A1: length 17.4
  Top Layer w0.254: U5.4 9.78,18.64 8.64,19.79 8.64,23.24 7.75,24.13 5.21,24.13 CN1.12
A1_3.3V: length 12.7
  Top Layer w0.254: U9.16 25.88,10.34 25.5,10.72 25.5,17.18 24.69,17.99 U5.20
A1_A: length 16.6
  Top Layer w0.254: U9.5 40.2,10.34 42.29,8.25 44.2,8.25 44.96,9.02 44.96,12.53 U1.68
A1_B: length 11.7
  Top Layer w0.254: U9.6 41.98,10.99 43.31,12.32 43.31,13.67 U1.67
A2: length 10.6
  Top Layer w0.254: CN1.13 8.64,27.94 9.88,26.7 U4.9
A2_3.3V: length 11.2
  Top Layer w0.254: U4.15 24.26,26.05 25.27,25.03 25.27,20.7 26.77,19.2 U8.18
A2_A: length 8.7
  Top Layer w0.254: U1.23 40.26,20.57 40.26,19.94 39.53,19.2 U8.3
A2_B: length 9.4
  Top Layer w0.254: U8.4 39.03,19.85 39.91,20.73 39.91,21.74 41.04,22.88 U1.21
A3: length 13.4
  Top Layer w0.254: U4.10 8.88,26.05 8.13,26.8 5.08,26.8 CN1.14
A3_3.3V: length 11.4
  Top Layer w0.254: U4.14 23.88,25.4 24.77,24.51 24.77,20.19 27.05,17.9 U8.20
A3_A: length 7.5
  Top Layer w0.254: U8.1 40.79,17.9 U1.27
A3_B: length 8.2
  Top Layer w0.254: 33.61,18.55 33.62,18.54 40.26,18.54 41.02,19.3 41.02,19.73 U1.25
A4: length 11.1
  Top Layer w0.254: CN1.15 7.55,30.48 10.03,28 U4.7
A4_3.3V: length 10.3
  Top Layer w0.254: U8.14 26.92,21.8 26.29,22.44 26.29,26.21 25.15,27.35 U4.17
A4_A: length 11.5
  Top Layer w0.254: U8.7 37.8,21.8 38.84,22.84 38.84,25.5 41.04,27.71 U1.15
A4_B: length 12.3
  Top Layer w0.254: U8.8 37.57,22.45 38.48,23.37 38.48,26.67 41.04,29.23 U1.13
CS: length 13.9
  Top Layer w0.254: CN1.16 5.21,29.21 8.04,29.21 9.91,27.35 U4.8
CS_3.3V: length 10.8
  Top Layer w0.254: U4.16 24.51,26.7 25.78,25.43 25.78,21.21 26.49,20.5 U8.16
CS_A: length 10
  Top Layer w0.254: U8.5 38.54,20.5 39.55,21.52 39.55,22.91 41.04,24.4 U1.19
CS_B: length 10.8
  Top Layer w0.254: U8.6 38.17,21.15 39.19,22.18 39.19,24.21 41.04,26.05 U1.17
DC_12V: length 91.5
  Top Layer w0.5: U3.1 18.23,52.77 C3.2 v1(16.51,50.8) ; v1(28.19,50.8) C1.2 26.43,52.77 U2.3
  Bottom Layer w0.5: U1.40 46.74,37.55 46.74,44.44 45.71,45.47 41.53,45.47 36.2,50.8 v1(28.19,50.8) v1(16.51,50.8) 8.25,50.8 2.67,45.21 2.67,24.13 CN1.10
EN: length 14.4
  Top Layer w0.254: CN1.18 5.21,31.75 7.18,31.75 10.29,28.65 U4.6
EN_3.3V: length 5.8
  Top Layer w0.254: U7.20 27.8,28 U4.18
EN_A: length 11
  Top Layer w0.254: U7.1 36.7,28.06 37.41,28.78 37.41,30.43 41.04,34.06 U1.7
EN_B: length 11.7
  Top Layer w0.254: U7.2 36.33,28.71 37.06,29.44 37.06,31.72 41.04,35.71 U1.5
LDO_3.3V: length 88.5
  Top Layer w0.254: 19.94,11.44 19.94,9.51 20.19,9.26 U6.8
  Top Layer w0.4: 19.94,19.96 19.95,19.94 U5.23 ; 19.94,32 20.04,31.9 U4.24 ; U5.24 20.03,20.59 19.94,20.5 ; U4.23 19.95,31.25 19.94,31.26
  Top Layer w0.5: 24.77,40.26 24.77,38.99 24.13,38.35 20.45,38.35 19.94,37.85 19.94,11.44 ; 29.53,30.09 C20.2 29.53,22.54 ; 29.53,30.09 29.45,30.01 U7.17 ; 29.53,30.09 29.53,32.65 ; 27.81,42.97 U2.4 29.53,41.64 C2.2 C18.2 C17.2 29.53,32.65 ; 29.53,12.28 29.53,10.14 29.09,9.69 U9.17 ; 29.53,12.28 C21.2 C22.2 29.53,19.84 ; 29.53,12.28 29.52,12.29 U9.13 ; 29.53,22.54 29.53,19.84 ; 29.53,22.54 29.44,22.45 U8.13 ; 29.53,19.84 29.52,19.85 U8.17 ; U7.13 29.49,32.61 29.53,32.65
LDO_5V: length 67.3
  Top Layer w0.4: U6.1 18.76,9.26 18.77,9.27
  Top Layer w0.5: U3.3 13.89,51.35 12.33,49.78 10.41,49.78 v1(10.29,49.66) ; 18.77,20.6 18.77,20.59 U5.1 ; 18.77,20.6 18.77,6.75 20.07,5.46 22.26,5.46 R1.1 ; 18.77,20.6 18.77,31.87 ; 18.77,31.87 18.75,31.9 U4.1 ; 18.77,31.87 18.77,37.98 18.27,38.48 10.67,38.48 9.78,39.37 v1(9.78,45.34)
  Bottom Layer w0.5: v1(10.29,49.66) 9.78,49.15 v1(9.78,45.34)
MCO: length 18.4
  Top Layer w0.254: U6.3 17.9,8.25 15.62,8.25 15.11,8.76 15.11,13.97 12.45,16.64 7.62,16.64 CN1.5
MCO_3.3V: length 21.1
  Top Layer w0.254: v4(23.24,9.02) 22.48,8.26 U6.6 ; v2(26.92,23.11) 27.85,23.11 U8.12
  Bottom Layer w0.254: v4(23.24,9.02) 23.24,22.35 24,23.11 v2(26.92,23.11)
MCO_A: length 13
  Top Layer w0.254: U8.9 37.2,23.1 38.13,24.03 38.13,27.97 41.04,30.88 U1.11
MCO_B: length 13.8
  Top Layer w0.254: 33.61,23.75 36.96,23.75 37.77,24.56 37.77,29.26 41.04,32.53 U1.9
MCU_VDD: length 101.3
  Top Layer w0.5: U1.46 48.89,34.91 48.89,47.24 47.4,48.74 6.32,48.74 0.76,43.18 0.76,15.88 CN1.2
RSTN: length 11
  Top Layer w0.254: CN1.7 7.07,20.32 9.4,17.99 U5.5
RSTN_3.3V: length 13.3
  Top Layer w0.254: U9.18 25.5,9.04 25.02,9.52 25.02,16.51 24.19,17.34 22.08,17.34
RSTN_A: length 22.3
  Top Layer w0.254: U1.64 45.97,14.72 45.97,7.87 45.34,7.24 40.77,7.24 38.96,9.04 U9.3
RSTN_B: length 19.4
  Top Layer w0.254: U1.66 45.47,13.63 45.47,8.51 44.7,7.75 41.57,7.75 39.62,9.69 U9.4
TAI: length 93.7
  Top Layer w0.254: CN1.4 1.52,17.65 1.52,42.16 7.49,48.13 46.86,48.13 48.13,46.86 48.13,35.74 U1.44
TAO: length 84.6
  Top Layer w0.254: U1.42 47.5,36.71 47.5,43.05 43.31,47.24 7.87,47.24 2.03,41.4 2.03,19.69 CN1.6
TCLK: length 13.8
  Top Layer w0.254: CN1.8 5.21,19.05 7.44,19.05 9.14,17.34 16.52,17.34
TCLK_3.3V: length 13.7
  Top Layer w0.254: U9.20 25.37,7.74 24.54,8.57 24.54,15.72 23.57,16.69 U5.18
TCLK_A: length 27.8
  Top Layer w0.254: U1.60 47.12,16.77 47.12,7.11 46.23,6.22 39.62,6.22 38.1,7.74 U9.1
TCLK_B: length 24.9
  Top Layer w0.254: U1.62 46.48,15.81 46.48,7.49 45.72,6.73 40.13,6.73 38.47,8.39 33.61,8.39
TDI: length 16.3
  Top Layer w0.254: CN1.20 5.21,34.29 8.38,34.29 9.14,33.53 9.14,31.22 10.41,29.95 U4.4
TDI_3.3V: length 6.3
  Top Layer w0.254: U7.16 26.76,30.66 25.4,29.3 U4.20
TDI_A: length 17
  Top Layer w0.254: U7.5 35.49,30.66 35.99,31.16 35.99,35.61 40.64,40.26 41.66,40.26 42.16,39.75 42.16,38.18 U1.2
TDI_B: length 24.3
  Top Layer w0.254: U7.6 35.31,31.31 35.63,31.64 35.63,36.91 42.41,43.69 44.32,43.69 45.08,42.93 45.08,41.05 U1.35
TDO: length 22.7
  Top Layer w0.254: v4(16,9.14) 16.39,8.76 U6.2
  Bottom Layer w0.254: CN1.9 6.98,22.86 8,21.84 8,20.83 8.51,20.32 12.19,20.32 14.35,18.16 14.35,9.84 15.04,9.14 v4(16,9.14)
TDO_3.3V: length 10.2
  Top Layer w0.254: v2(26.54,12.95) 27.85,12.95 U9.12 ; v2(23.88,12.95) 23.88,10.8 21.84,8.76 U6.7
  Bottom Layer w0.254: v2(23.88,12.95) v2(26.54,12.95)
TDO_A: length 9
  Top Layer w0.254: U9.9 38.98,12.94 39.37,13.33 39.37,14.48 39.88,14.99 41.01,14.99 U1.31
TDO_B: length 9.9
  Top Layer w0.254: U9.10 38.23,13.59 38.73,14.1 38.73,16.13 39.16,16.55 U1.29
TST_A: length 25.9
  Top Layer w0.254: U1.36 45.47,39.48 45.47,43.31 44.58,44.2 41.4,44.2 35.28,38.07 35.28,32.19 35.05,31.96 U7.7
TST_B: length 29
  Top Layer w0.254: U7.8 34.67,32.61 34.92,32.86 34.92,39.37 40.26,44.7 45.08,44.7 45.97,43.81 45.97,38.38 U1.38
TSTROBE: length 14.3
  Top Layer w0.254: U4.3 10.41,30.6 9.65,31.36 9.65,35.05 9.14,35.56 CN1.19
TSTROBE_3.3V: length 6.6
  Top Layer w0.254: U7.14 26.76,31.96 24.75,29.95 U4.21
WR: length 12.6
  Top Layer w0.254: U4.5 10.29,29.3 8.64,30.95 8.64,32.64 8.25,33.02 CN1.17
WR_3.3V: length 6.1
  Top Layer w0.254: U7.18 26.76,29.36 26.05,28.65 U4.19
WR_A: length 12.5
  Top Layer w0.254: U7.3 35.97,29.36 36.7,30.1 36.7,32.89 41.04,37.23 U1.3
WR_B: length 13.3
  Top Layer w0.254: U1.1 41.04,38.88 36.35,34.19 36.35,30.63 35.73,30.01 U7.4
$1N4575: length 1.9
  Top Layer w0.254: U6.5 21.6,7.76 R1.2

## Copper pours and planes (outline as drawn; the poured copper is in the pictures)
GND on Top Layer: 0,55.6 54.72,55.6 54.72,0 0,0
GND on Bottom Layer: 0,55.6 54.72,55.6 54.72,0 0,0

## Text on the board
Top Silkscreen Layer: LVDS_VHDCI_MCU_1.0 | 澎湃微电子

# Board LVDS_VHDCI_NI_1
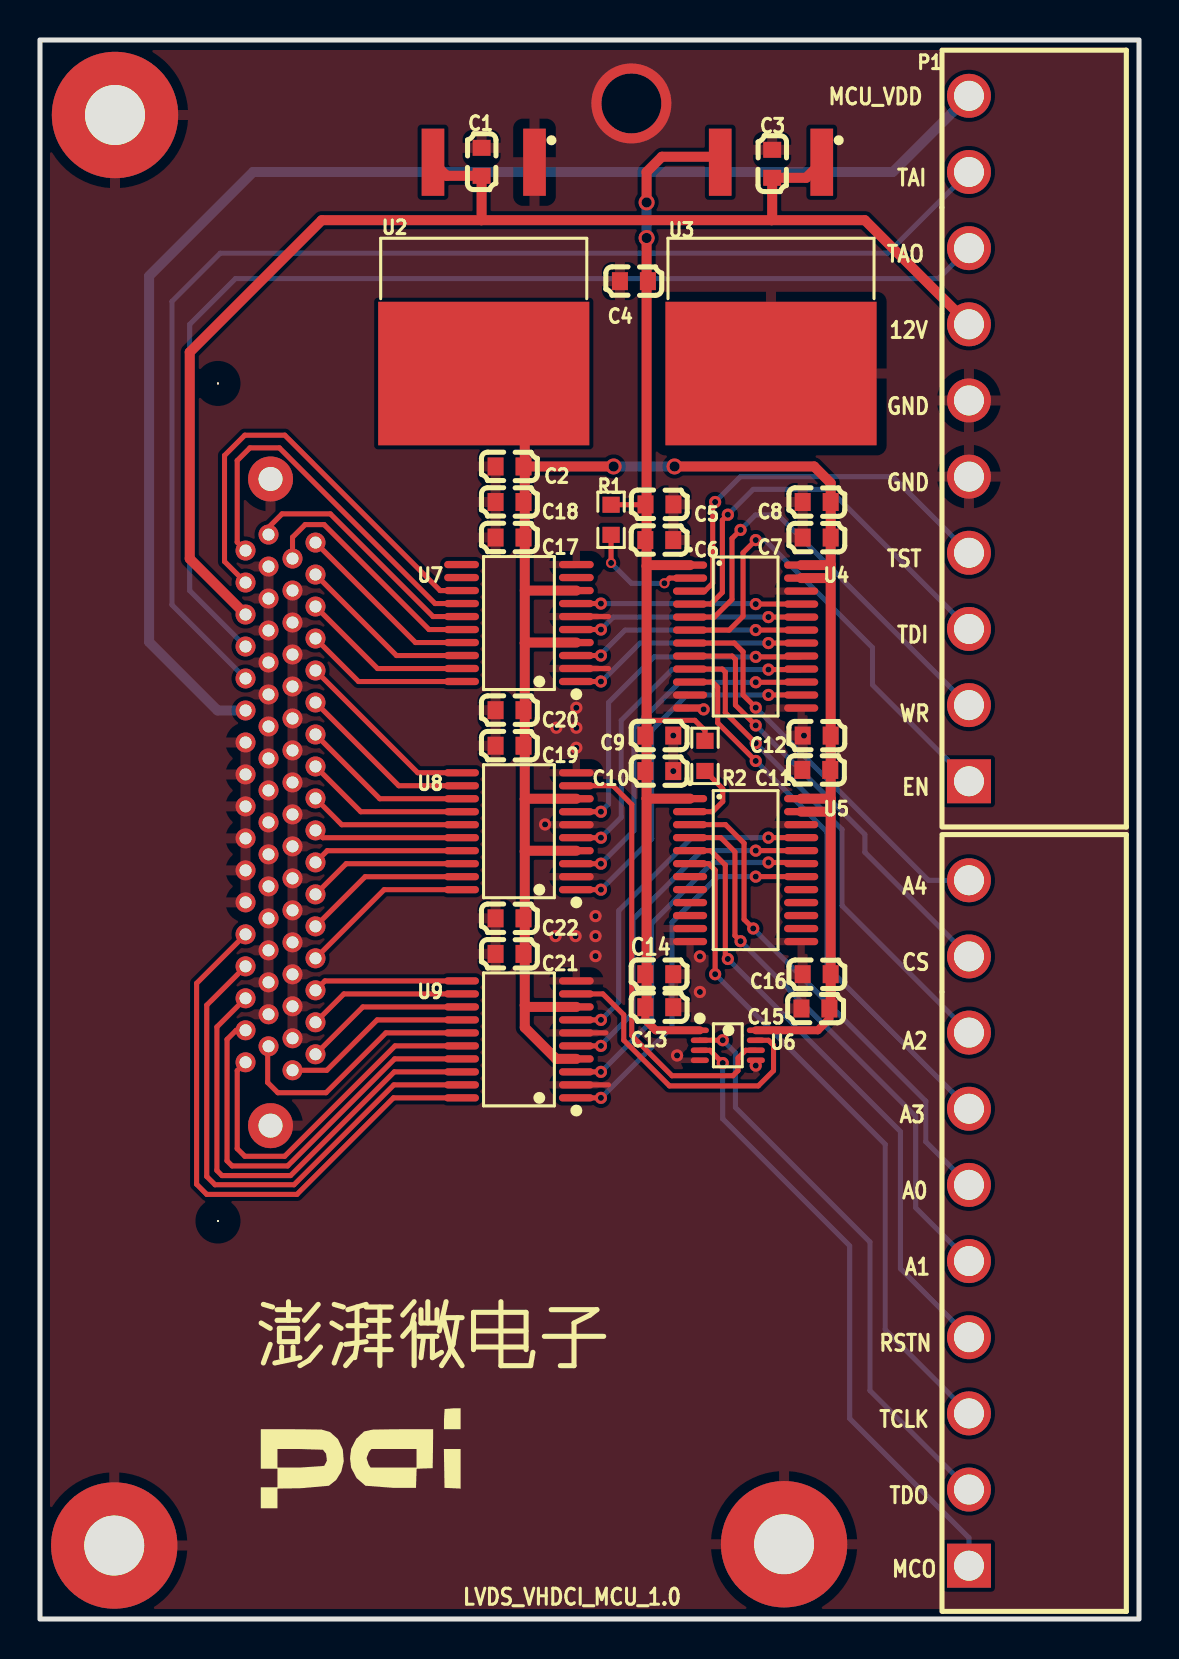
[diagram p4: board, top side]
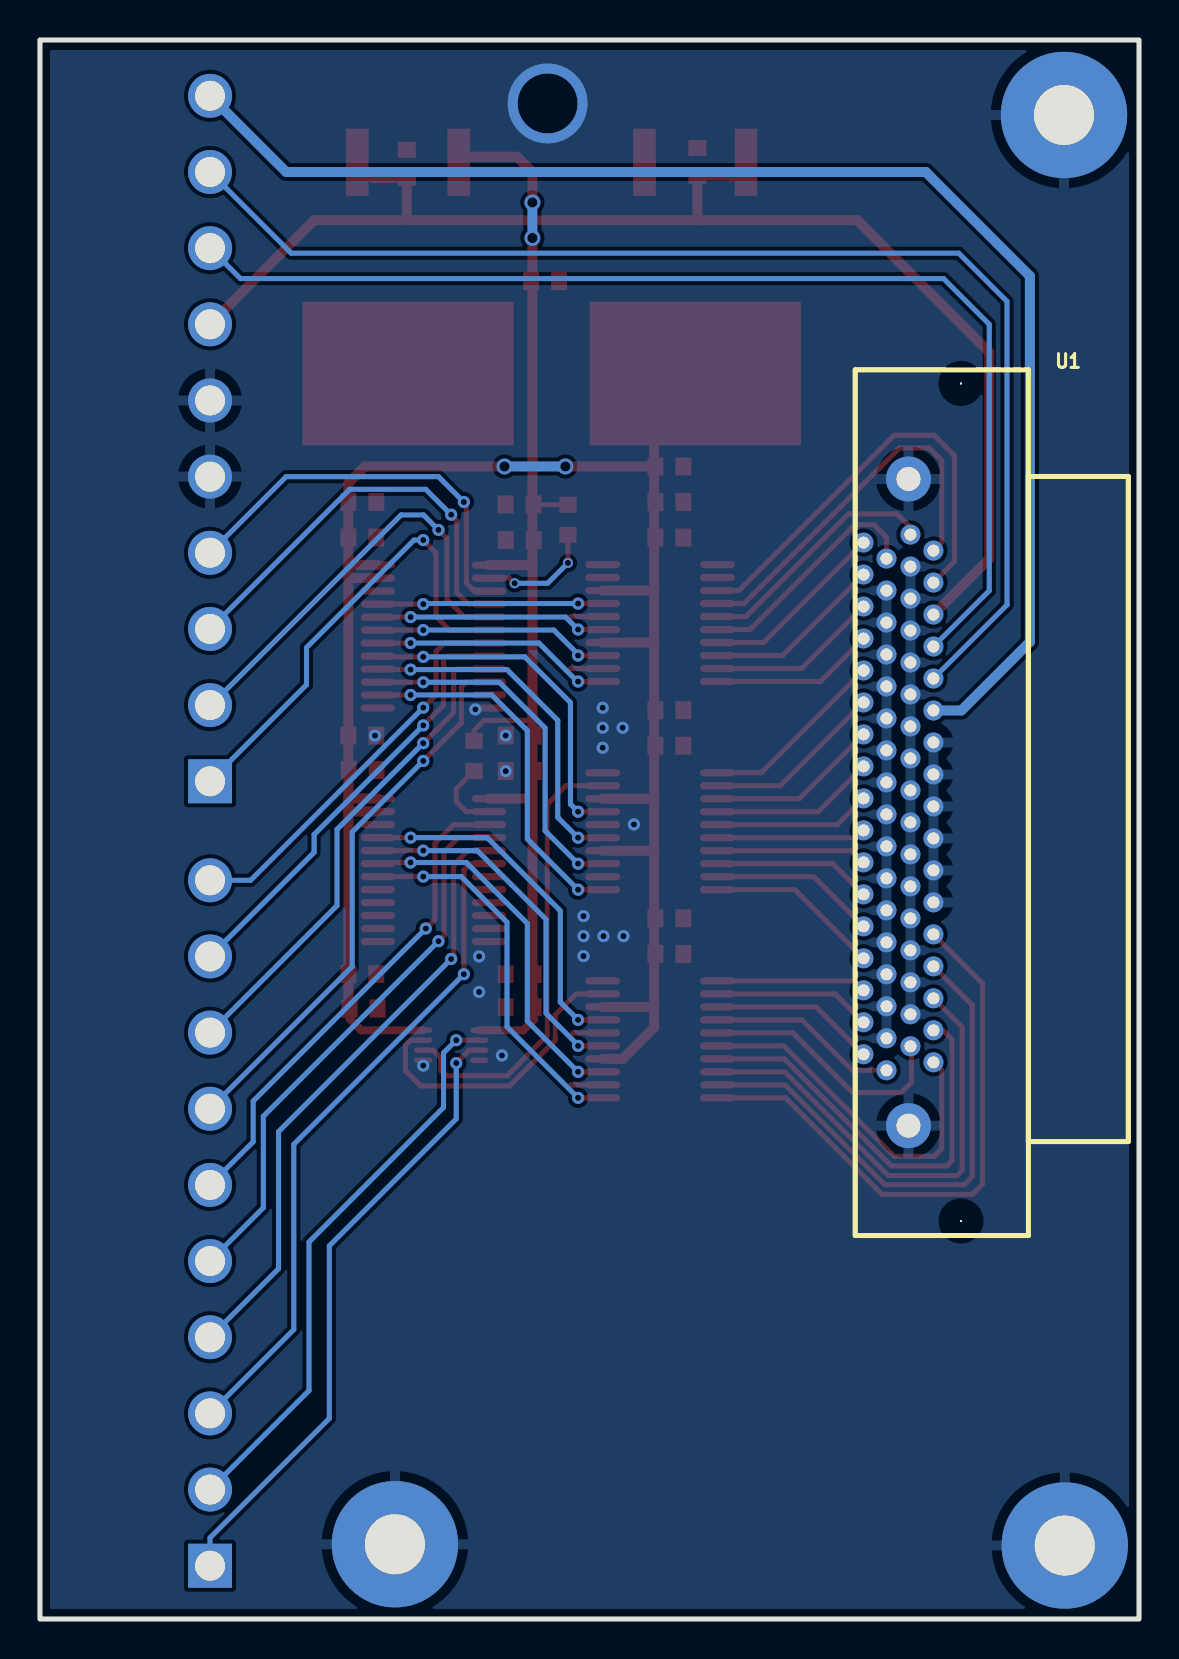
[diagram p5: board, bottom side, seen from below]

Outline 54.99 x 78.99 mm; copper layers: Top Layer, Bottom Layer. Coordinates in mm from the lower left corner of the outline.
Outline path: rectangle 0,78.99 54.99,0
Stack: Top Layer 0.035mm / Dielectric1 1.51mm FR4 er 4.5 / Bottom Layer 0.035mm

## Design rules (mm)
template: 自定义配置
spacing copperThickness1oz (default): track to track 0.102, other pairs 0.152 to 0.3
spacing copperThickness2oz: track to track 0.203, other pairs 0.152 to 0.3
track width copperThickness1oz (default): min 0.127, default 0.254, max 2.54
track width copperThickness2oz: min 0.203, default 0.254, max 2.54
differential pair differentialPair (default): width min 0.127, default 0.254, max 2.54; gap min 0.152, default 0.152
via viaSize (default): diameter min 0.5, default 0.61, max 10; hole min 0.3, default 0.305, max 6.3

## Placement (name value [footprint] x y rotation side)
C1  10uF  [C0603]  22.1 72.9 270 top
C2  10uF  [C0603]  23.49 57.66 0 top
C3  10uF  [C0603]  36.64 72.8 270 top
C4  10uF  [C0603]  29.72 66.93 0 top
C5  10uF  [C0603]  31 55.76 0 top
C6  100nF  [C0603]  30.99 53.98 0 top
C7  100nF  [C0603]  38.86 54.1 180 top
C8  10uF  [C0603]  38.86 55.88 180 top
C9  10uF  [C0603]  30.99 44.2 0 top
C10  100nF  [C0603]  30.99 42.42 0 top
C11  100nF  [C0603]  38.84 42.48 180 top
C12  10uF  [C0603]  38.86 44.2 180 top
C13  10uF  [C0603]  30.99 30.61 0 top
C14  100nF  [C0603]  30.99 32.26 0 top
C15  100nF  [C0603]  38.8 30.54 180 top
C16  10uF  [C0603]  38.86 32.26 180 top
C17  100nF  [C0603]  23.49 54.1 0 top
C18  10uF  [C0603]  23.49 55.88 0 top
C19  100nF  [C0603]  23.49 43.69 0 top
C20  10uF  [C0603]  23.49 45.47 0 top
C21  100nF  [C0603]  23.49 33.27 0 top
C22  10uF  [C0603]  23.49 35.05 0 top
J6  -  [DEMO板安装孔]  3.75 75.24 0 top
J7  -  [DEMO板安装孔]  3.72 3.68 0 top
J8  -  [DEMO板安装孔]  37.23 3.74 0 top
P1  WJ15EDGRC-3.81-10P  [CONN-TH_10P-P3.81_WJ15EDGRC-3.81-10P]  46.48 59.06 90 top
P2  WJ15EDGRC-3.81-10P  [CONN-TH_10P-P3.81_WJ15EDGRC-3.81-10P]  46.48 19.81 90 top
R1  4.7kΩ  [R0603]  28.58 54.99 270 top
R2  4.7kΩ  [R0603]  33.27 43.18 270 top
U1  -  [VHDCI_68P]  5.17 39.41 180 bottom
U2  3.3V  [TO-263-2_L10.0-W9.1-P5.08-LS15.2-TL]  22.2 67.59 270 top
U3  5V  [TO-263-2_L10.0-W9.1-P5.08-LS15.2-TL]  36.58 67.59 270 top
U4  SN74LXC8T245PWR  [TSSOP-24_L7.8-W4.4-P0.65-LS6.4-BL_1]  35.31 49.15 270 top
U5  SN74LXC8T245PWR  [TSSOP-24_L7.8-W4.4-P0.65-LS6.4-BL_1]  35.31 37.47 270 top
U6  SN74LXC2T45QDCURQ1  [VSSOP-8_L2.4-W2.1-P0.50-LS3.2-BL]  34.42 28.7 270 top
U7  SN65LVDT41QPWREP  [TSSOP-20_L6.5-W4.4-P0.65-LS6.4-BL]  23.97 49.83 90 top
U8  SN65LVDT41QPWREP  [TSSOP-20_L6.5-W4.4-P0.65-LS6.4-BL]  23.97 39.41 90 top
U9  SN65LVDT41QPWREP  [TSSOP-20_L6.5-W4.4-P0.65-LS6.4-BL]  23.97 29 90 top

## Footprints (pads in the part's own frame, mm; a bottom-side part is the same pattern mirrored in y, then rotated)
C0603
  rect 0.8x0.9 smd: 1(-0.7,0) 2(0.7,0)
CONN-TH_10P-P3.81_WJ15EDGRC-3.81-10P
  rect 2.2x2.2 hole 1.5: 1(-17.145,0)
  round 2.2 hole 1.5: 2(-13.335,0) 3(-9.525,0) 4(-5.715,0) 5(-1.905,0) 6(1.905,0) 7(5.715,0) 8(9.525,0) 9(13.335,0) 10(17.145,0)
DEMO板安装孔
  round 6.32 hole 3: 1(0,0)
R0603
  rect 0.806x0.864 smd: 1(-0.753,0) 2(0.753,0)
TO-263-2_L10.0-W9.1-P5.08-LS15.2-TL
  rect 3.358x1.134 smd: 1(-5.286,2.54) 3(-5.286,-2.54)
  rect 7.181x10.566 smd: 4(5.286,0)
TSSOP-20_L6.5-W4.4-P0.65-LS6.4-BL
  oval 0.364x1.742 smd: 1(-2.925,-2.871) 2(-2.275,-2.871) 3(-1.625,-2.871) 4(-0.975,-2.871) 5(-0.325,-2.871) 6(0.325,-2.871) 7(0.975,-2.871) 8(1.625,-2.871) 9(2.275,-2.871) 10(2.925,-2.871) 11(2.925,2.871) 12(2.275,2.871) 13(1.625,2.871) 14(0.975,2.871) 15(0.325,2.871) 16(-0.325,2.871) 17(-0.975,2.871) 18(-1.625,2.871) 19(-2.275,2.871) 20(-2.925,2.871)
TSSOP-24_L7.8-W4.4-P0.65-LS6.4-BL_1
  oval 0.364x1.71 smd: 1(-3.575,-2.78) 2(-2.925,-2.78) 3(-2.275,-2.78) 4(-1.625,-2.78) 5(-0.975,-2.78) 6(-0.325,-2.78) 7(0.325,-2.78) 8(0.975,-2.78) 9(1.625,-2.78) 10(2.275,-2.78) 11(2.925,-2.78) 12(3.575,-2.78) 13(3.575,2.78) 14(2.925,2.78) 15(2.275,2.78) 16(1.625,2.78) 17(0.975,2.78) 18(0.325,2.78) 19(-0.325,2.78) 20(-0.975,2.78) 21(-1.625,2.78) 22(-2.275,2.78) 23(-2.925,2.78) 24(-3.575,2.78)
VHDCI_68P
  round 1 hole 0.6: 1(-8.617,14.441) 2(-7.466,13.64) 3(-8.617,12.841) 4(-7.466,12.04) 5(-8.617,11.241) 6(-7.466,10.441) 7(-8.617,9.64) 8(-7.466,8.841) 9(-8.617,8.04) 10(-7.466,7.24) 11(-8.617,6.441) 12(-7.466,5.641) 13(-8.617,4.84) 14(-7.466,4.04) 15(-8.617,3.24) 16(-7.466,2.441) 17(-8.617,1.641) 18(-7.466,0.841) 19(-8.617,0.041) 20(-7.466,-0.759) 21(-8.617,-1.56) 22(-7.466,-2.36) 23(-8.617,-3.159) 24(-7.466,-3.959) 25(-8.617,-4.76) 26(-7.466,-5.559) 27(-8.617,-6.359) 28(-7.466,-7.16) 29(-8.617,-7.96) 30(-7.466,-8.759) 31(-8.617,-9.559) 32(-7.466,-10.36) 33(-8.617,-11.159) 34(-7.466,-11.96) 35(-6.266,14.841) 36(-5.117,14.04) 37(-6.266,13.241) 38(-5.117,12.441) 39(-6.266,11.64) 40(-5.117,10.841) 41(-6.266,10.04) 42(-5.117,9.241) 43(-6.266,8.441) 44(-5.117,7.641) 45(-6.266,6.84) 46(-5.117,6.04) 47(-6.266,5.24) 48(-5.117,4.441) 49(-6.266,3.64) 50(-5.117,2.841) 51(-6.266,2.041) 52(-5.117,1.24) 53(-6.266,0.441) 54(-5.117,-0.359) 55(-6.266,-1.159) 56(-5.117,-1.96) 57(-6.266,-2.76) 58(-5.117,-3.559) 59(-6.266,-4.359) 60(-5.117,-5.16) 61(-6.266,-5.96) 62(-5.117,-6.76) 63(-6.266,-7.559) 64(-5.117,-8.36) 65(-6.266,-9.159) 66(-5.117,-9.96) 67(-6.266,-10.759) 68(-5.117,-11.559)
  round 2.25 hole 1.2: 69(-6.367,17.62) 70(-6.367,-14.729)
  round 0.1 hole 1.75: 71(-3.736,22.401) 72(-3.736,-19.5)
VSSOP-8_L2.4-W2.1-P0.50-LS3.2-BL
  oval 0.28x0.905 smd: 1(-0.75,-1.403) 2(-0.25,-1.403) 3(0.25,-1.403) 4(0.75,-1.403) 5(0.75,1.403) 6(0.25,1.403) 7(-0.25,1.403) 8(-0.75,1.403)

## Nets
As in the schematic.

Pads without a net: U1 71 72; U5 7 8 9 10 14 15 16 17; U7 9 11 12

## Via types
v1: diameter 0.61, hole 0.305, Top Layer to Bottom Layer, 56 vias
v2: diameter 4, hole 3, Top Layer to Bottom Layer, 1 via
v3: diameter 0.8, hole 0.51, Top Layer to Bottom Layer, 4 vias
v4: diameter 0.51, hole 0.305, Top Layer to Bottom Layer, 2 vias

## Routing (per net, layer and track width the routed paths; a pad name or vN(x,y) marks a point on that pad's centre or on a via; arc(x,y) is an arc through that point)
GND: length 6.3
  Top Layer w0.254: U9.2 28.45,26.72 ; U7.6 28.45,50.15 ; U9.6 28.32,29.32 ; U7.2 28.45,47.55
  vias: v1(25.27,39.75) v1(25.8,34.16) v1(25.84,44.59) v1(26.8,34.16) v1(26.84,45.59) v1(26.84,44.59) v1(26.84,43.59) v1(27.8,35.16) v1(27.8,34.16) v1(27.8,33.16) v1(31.69,44.2) v1(31.69,42.42) v1(31.88,28.19) v1(33.02,33.15) v1(33.02,31.37) v1(33.21,45.51) v1(35.81,27.69) v1(38.23,44.2) v2(29.59,75.82)
A0: length 24.8
  Top Layer w0.254: U5.3 34.3,39.74 35.23,38.81 35.23,35 v1(35.69,34.54)
  Bottom Layer w0.254: v1(35.69,34.54) 44.32,25.91 44.32,23.88 P2.6
A0_3.3V: length 17.7
  Top Layer w0.254: U9.7 v1(28.07,29.97) ; U5.21 v1(36.45,39.09)
  Bottom Layer w0.254: v1(28.07,29.97) 28.96,30.86 28.96,35.43 32.61,39.09 v1(36.45,39.09)
A0_A: length 9.5
  Top Layer w0.254: U9.14 16.87,29.97 14.35,27.45 U1.34
A0_B: length 8.3
  Top Layer w0.254: 13.79,28.25 16.16,30.62 U9.13
A1: length 27.9
  Top Layer w0.254: U5.4 34.06,39.09 34.77,38.38 34.77,34.19 v1(35.05,33.91)
  Bottom Layer w0.254: v1(35.05,33.91) 43.82,25.15 43.82,20.57 P2.5
A1_3.3V: length 18.1
  Top Layer w0.254: U9.5 v1(28.07,28.67) ; U5.20 v1(35.81,38.44)
  Bottom Layer w0.254: v1(35.81,38.44) 33.11,38.44 29.67,35.01 29.67,30.31 28.07,28.7 v1(28.07,28.67)
A1_A: length 18.2
  Top Layer w0.254: U9.16 17.77,28.67 12.24,23.15 10.25,23.15 9.87,23.53 9.87,27.43 U1.68
A1_B: length 13
  Top Layer w0.254: U1.67 11.39,28.61 11.39,26.84 11.9,26.33 14.31,26.33 17.31,29.32 U9.15
A2: length 24.9
  Top Layer w0.254: U4.9 34.14,47.52 34.29,47.37 34.29,45.34 v1(35.81,43.81)
  Bottom Layer w0.254: P2.8 40.13,35.69 40.13,39.5 v1(35.81,43.81)
A2_3.3V: length 18
  Top Layer w0.254: U4.15 38.08,46.86 v1(35.81,46.86) ; U8.3 v1(28.07,37.79)
  Bottom Layer w0.254: v1(35.81,46.86) 32,46.86 29.72,44.58 29.72,39.44 v1(28.07,37.79)
A2_A: length 7.9
  Top Layer w0.254: U8.18 15.32,37.79 13.79,36.25
A2_B: length 7.6
  Top Layer w0.254: 13.79,37.85 14.37,38.44 U8.17
A3: length 27.8
  Top Layer w0.254: v1(35.81,42.93) 33.91,44.83 33.91,46.61 33.64,46.87 U4.10
  Bottom Layer w0.254: v1(35.81,42.93) 39.37,39.37 39.37,32.64 46.48,25.53
A3_3.3V: length 18.5
  Top Layer w0.254: U4.14 38.08,46.23 v1(36.45,46.23) ; U8.1 v1(28.07,36.49)
  Bottom Layer w0.254: v1(28.07,36.49) 30.61,39.03 30.61,44.45 32.39,46.23 v1(36.45,46.23)
A3_A: length 8.7
  Top Layer w0.254: U8.20 17.22,36.49 13.79,33.05
A3_B: length 8.3
  Top Layer w0.254: 13.79,34.65 16.27,37.14 U8.19
A4: length 20.1
  Top Layer w0.254: v1(35.81,45.59) 35.18,46.23 35.18,48.39 34.74,48.82 U4.7
  Bottom Layer w0.254: v1(35.81,45.59) 44.45,36.96 P2.10
A4_3.3V: length 17.5
  Top Layer w0.254: v1(35.81,48.13) 38.05,48.13 U4.17 ; U8.7 v1(28.07,40.39)
  Bottom Layer w0.254: v1(28.07,40.39) 28.45,40.77 28.45,45.85 30.73,48.13 v1(35.81,48.13)
A4_A: length 8.2
  Top Layer w0.254: U8.14 16.05,40.39 13.79,42.65
A4_B: length 8.6
  Top Layer w0.254: U8.13 17,41.04 13.79,44.25
CS: length 22
  Top Layer w0.254: U4.8 34.63,48.17 34.8,48.01 34.8,45.72 v1(35.81,44.7)
  Bottom Layer w0.254: v1(35.81,44.7) 41.27,39.24 41.27,38.35 46.48,33.15
CS_3.3V: length 17.6
  Top Layer w0.254: U8.5 v1(28.07,39.09) ; U4.16 38.06,47.5 v1(36.45,47.5)
  Bottom Layer w0.254: v1(36.45,47.5) 31.62,47.5 29.08,44.96 29.08,40.1 v1(28.07,39.09)
CS_A: length 7.5
  Top Layer w0.254: 13.79,39.45 14.15,39.09 U8.16
CS_B: length 7.9
  Top Layer w0.254: U8.15 15.1,39.74 13.79,41.05
DC_12V: length 68
  Top Layer w0.5: 22.09,69.98 22.1,69.98 C1.2 20.35,72.2 U2.3 ; 22.09,69.98 14.1,69.98 7.49,63.37 7.49,53.04 U1.40 ; 22.09,69.98 36.6,69.98 ; 36.6,69.98 41.27,69.98 P1.7 ; 36.6,69.98 36.64,70.01 C3.2 38.34,72.1 U3.1
EN: length 23.8
  Top Layer w0.254: U4.6 34.49,49.47 35.18,50.17 35.18,53.34 v1(35.81,53.98)
  Bottom Layer w0.254: v1(35.81,53.98) 36.28,53.98 41.66,48.6 41.66,46.74 P1.1
EN_3.3V: length 12.1
  Top Layer w0.254: U7.1 v1(28.07,46.9) ; U4.18 v1(36.45,48.82)
  Bottom Layer w0.254: v1(28.07,46.9) 28.07,46.86 30.03,48.82 v1(36.45,48.82)
EN_A: length 8.2
  Top Layer w0.254: 13.79,49.05 15.94,46.9 U7.20 21.1,46.9
EN_B: length 8.6
  Top Layer w0.254: U7.19 16.89,47.55 13.79,50.65
LDO_3.3V: length 102.2
  Top Layer w0.4: U6.8 38.92,29.45 39.5,30.03 C15.1
  Top Layer w0.5: 24.26,41.02 24.27,41.04 U8.8 ; 24.26,41.02 24.26,48.82 ; 24.26,41.02 24.26,38.4 ; 39.56,52.15 C12.1 39.56,41.03 ; 39.56,52.15 39.49,52.07 U4.23 ; 39.56,52.15 39.56,52.73 ; 39.56,52.73 39.56,52.72 U4.24 ; 39.56,52.73 C7.1 C8.1 39.56,56.83 38.73,57.66 v3(31.75,57.66) ; 24.26,30.7 24.26,29.59 25.83,28.02 U9.4 ; 24.26,30.7 24.33,30.62 U9.8 ; 24.26,30.7 24.26,38.4 ; 24.26,57.66 v3(28.7,57.66) ; 24.26,57.66 C2.2 ; 24.26,57.66 24.26,60.25 22.2,62.31 ; 24.26,57.66 24.26,48.82 ; U7.4 24.28,48.85 24.26,48.82 ; C15.1 39.56,30.6 C16.1 39.56,40.37 ; 24.26,38.4 24.29,38.44 U8.4 ; 39.56,41.03 39.55,41.04 U5.24 ; 39.56,41.03 39.56,40.37 ; 39.56,40.37 39.54,40.39 U5.23 ; U7.8 24.26,51.45
  Bottom Layer w0.5: v3(28.7,57.66) v3(31.75,57.66)
LDO_5V: length 59.3
  Top Layer w0.254: 30.35,45.15 30.54,44.96 32.77,44.96 33.27,44.45 R2.1 ; C5.1 30.28,55.74 R1.1
  Top Layer w0.4: 30.29,30.61 30.29,29.97 30.81,29.45 U6.1
  Top Layer w0.5: 30.35,41.04 30.35,52.68 ; 30.35,41.04 30.35,30.67 30.29,30.61 ; 30.35,41.04 30.36,41.04 U5.1 ; v3(30.35,69.09) 30.35,52.68 ; 30.35,52.68 30.4,52.72 U4.1 ; U3.3 33.76,73.15 31.11,73.15 30.35,72.39 v3(30.35,70.87)
  Bottom Layer w0.5: v3(30.35,70.87) v3(30.35,69.09)
MCO: length 31.7
  Top Layer w0.254: v1(34.16,27.81) 33.52,28.45 U6.3
  Bottom Layer w0.254: v1(34.16,27.81) 34.16,25.02 40.51,18.67 40.51,10.03 46.48,4.06 P2.1
MCO_3.3V: length 22.7
  Top Layer w0.254: U8.9 28.67,41.69 29.61,40.75 29.61,29.19 31.62,27.18 34.67,27.18 34.92,27.43 34.92,28.07 35.31,28.45 U6.6
MCO_A: length 9
  Top Layer w0.254: U8.12 17.95,41.69 13.79,45.85
MCO_B: length 9.4
  Top Layer w0.254: U8.11 18.9,42.34 13.79,47.45
MCU_VDD: length 69.3
  Bottom Layer w0.5: U1.46 8.89,45.45 5.46,48.88 5.46,67.18 10.67,72.39 42.67,72.39 P1.10
RSTN: length 30.7
  Top Layer w0.254: v1(34.42,33.02) 34.29,33.15 34.29,37.72 33.57,38.44 U5.5
  Bottom Layer w0.254: v1(34.42,33.02) 43.05,24.38 43.05,17.53 P2.4
RSTN_3.3V: length 18.5
  Top Layer w0.254: U5.19 38.03,37.85 v1(36.45,37.85) ; U9.3 v1(28.07,27.37)
  Bottom Layer w0.254: v1(36.45,37.85) 33.66,37.85 30.61,34.8 30.61,29.91 v1(28.07,27.37)
RSTN_A: length 23.7
  Top Layer w0.254: U1.64 8.85,29.62 8.85,22.44 9.11,22.18 12.54,22.18 17.73,27.37 U9.18
RSTN_B: length 21.2
  Top Layer w0.254: U1.66 9.81,29.45 9.36,29 9.36,22.92 9.61,22.67 12.39,22.67 17.75,28.02 U9.17
TAI: length 62.9
  Bottom Layer w0.254: U1.44 6.6,50.73 6.6,65.91 9.02,68.33 42.42,68.33 P1.9
TAO: length 57.8
  Bottom Layer w0.254: P1.8 44.96,67.06 9.78,67.06 7.49,64.77 7.49,51.44 U1.42
TCLK: length 33.8
  Top Layer w0.254: v1(33.78,32.26) 33.78,37.47 33.46,37.79 U5.6
  Bottom Layer w0.254: v1(33.78,32.26) 42.29,23.75 42.29,14.48 P2.3
TCLK_3.3V: length 18.9
  Top Layer w0.254: U9.1 v1(28.07,26.07) ; U5.18 v1(35.81,37.14)
  Bottom Layer w0.254: v1(28.07,26.07) 31.62,29.63 31.62,34.85 33.91,37.14 v1(35.81,37.14)
TCLK_A: length 29
  Top Layer w0.254: U1.60 7.84,31.8 7.84,21.75 8.34,21.24 12.86,21.24 17.69,26.07 U9.20
TCLK_B: length 26.3
  Top Layer w0.254: U1.62 8.34,30.71 8.34,22.14 8.76,21.73 12.71,21.73 17.71,26.72 U9.19
TDI: length 21.3
  Top Layer w0.254: v1(34.42,55.25) 34.14,54.97 34.14,51.36 33.56,50.77 U4.4
  Bottom Layer w0.254: P1.3 39.5,56.52 35.69,56.52 v1(34.42,55.25)
TDI_3.3V: length 11.5
  Top Layer w0.254: U4.20 v1(36.45,50.12) ; U7.5 v1(28.07,49.5)
  Bottom Layer w0.254: v1(36.45,50.12) 28.69,50.12 v1(28.07,49.5)
TDI_A: length 12
  Top Layer w0.254: U7.16 19.46,49.5 14.21,54.75 13.27,54.75 12.64,54.12 U1.2
TDI_B: length 12.4
  Top Layer w0.254: U7.15 19.67,50.15 14.53,55.29 12.11,55.29 11.44,54.61 U1.35
TDO: length 28.7
  Top Layer w0.254: U6.2 33.02,28.96 v1(34.16,28.96)
  Bottom Layer w0.254: v1(34.16,28.96) 34.8,28.32 34.8,25.59 41.53,18.86 41.53,11.43 P2.2
TDO_3.3V: length 15.1
  Top Layer w0.254: U6.7 36.45,28.95 36.7,28.7 36.7,27.43 35.94,26.67 31.5,26.67 29.21,28.96 29.21,30.23 28.16,31.27 U9.9
TDO_A: length 7.9
  Top Layer w0.254: 13.79,29.85 15.21,31.27 U9.12
TDO_B: length 7.5
  Top Layer w0.254: 13.79,31.45 14.26,31.92 U9.11
TST_A: length 19.4
  Top Layer w0.254: U7.14 19.77,50.8 11.98,58.59 10.5,58.59 9.87,57.95 9.87,53.87 U1.36
TST_B: length 22.3
  Top Layer w0.254: U1.38 9.23,52.9 9.23,58.21 10.25,59.22 12.25,59.22 20.02,51.45 U7.13
TSTROBE: length 20.2
  Top Layer w0.254: v1(33.78,55.88) 33.66,55.76 33.66,51.82 33.26,51.42 U4.3
  Bottom Layer w0.254: P1.4 42.67,57.15 35.05,57.15 v1(33.78,55.88)
TSTROBE_3.3V: length 11.3
  Top Layer w0.254: U4.21 v1(35.81,50.77) ; v1(28.07,50.8) U7.7
  Bottom Layer w0.254: v1(35.81,50.77) 35.79,50.8 v1(28.07,50.8)
WR: length 21.8
  Top Layer w0.254: U4.5 33.74,50.12 34.63,51.01 34.63,54.06 v1(35.05,54.48)
  Bottom Layer w0.254: P1.2 46.44,45.72 36.92,55.23 35.8,55.23 v1(35.05,54.48)
WR_3.3V: length 11.8
  Top Layer w0.254: U4.19 v1(35.81,49.47) ; U7.3 v1(28.07,48.2)
  Bottom Layer w0.254: v1(28.07,48.2) 28.07,48.26 29.28,49.47 v1(35.81,49.47)
WR_A: length 9
  Top Layer w0.254: 13.79,52.25 17.84,48.2 U7.18
WR_B: length 9.4
  Top Layer w0.254: 13.79,53.85 18.79,48.85 U7.17
$1N21690: length 5.8
  Top Layer w0.254: U4.2 31.5,52.07 v4(31.24,51.82) ; v4(28.58,52.83) 28.58,54.11
  Bottom Layer w0.254: v4(28.58,52.83) 29.59,51.82 v4(31.24,51.82)
$1N21773: length 3.7
  Top Layer w0.254: R2.2 34.16,41.54 34.16,40.89 33.66,40.39 U5.2

## Copper pours and planes (outline as drawn; the poured copper is in the pictures)
GND on Top Layer: 0,78.99 54.99,78.99 54.99,0 0,0
GND on Bottom Layer: 0,78.99 54.99,78.99 54.99,0 0,0

## Text on the board
Top Silkscreen Layer: LVDS_VHDCI_MCU_1.0 | C14 | MCU_VDD | RSTN | TCLK | TAO | GND | TST | 12V | TDO | MCO | TAI | TDI | WR | A3 | EN | A4 | CS | A2 | A0 | A1 | 澎湃微电子
